# EasyEDA Pro project ProPrj_ETHlink8xADC_2025-03-31.epro, board ETHlink8xADC_PCB
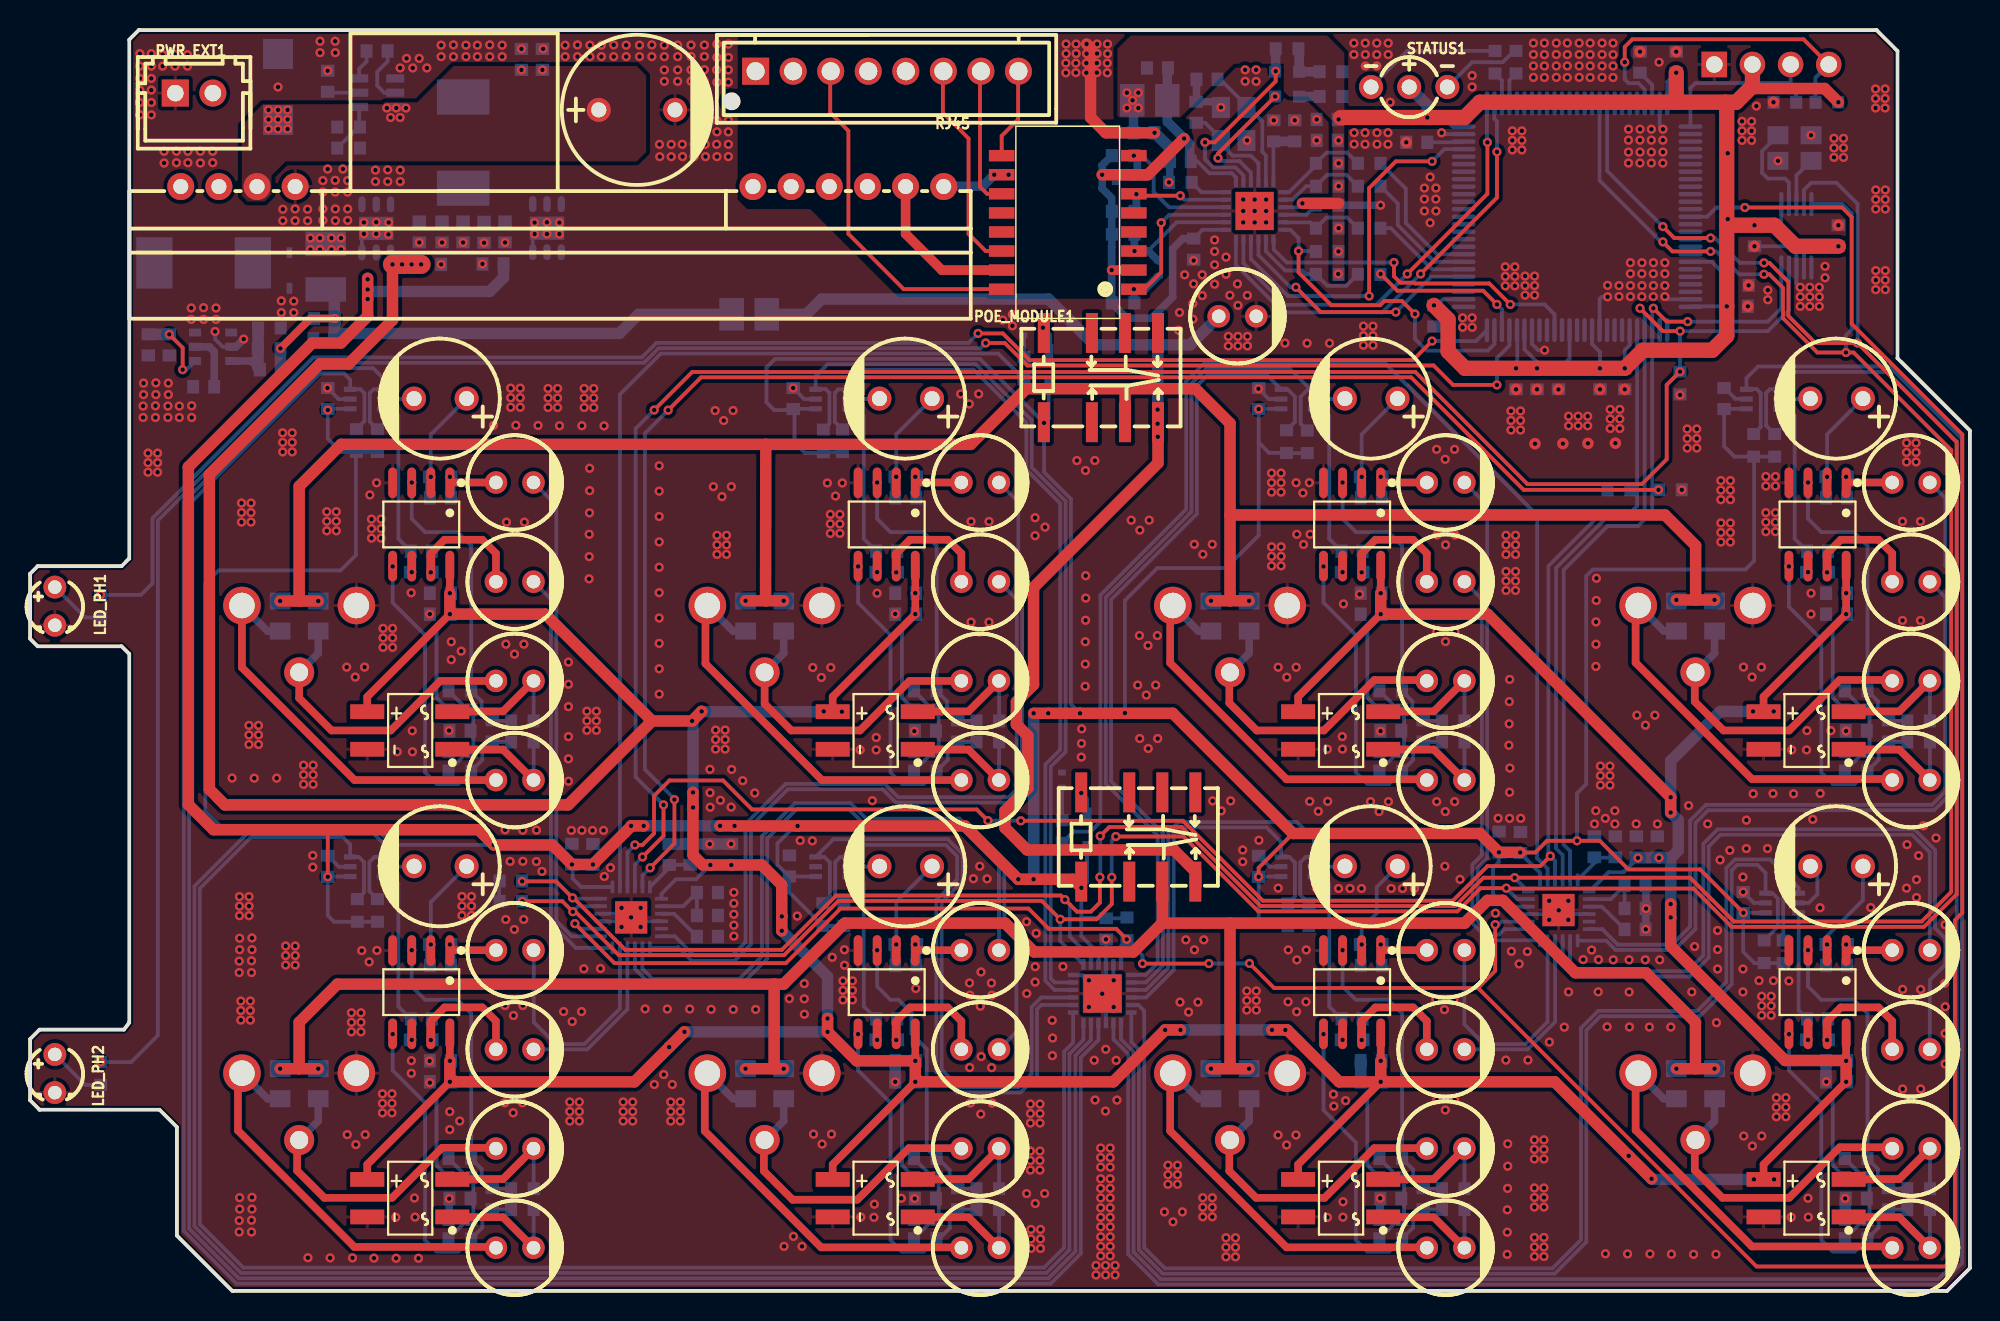
[diagram p13: board, top side]
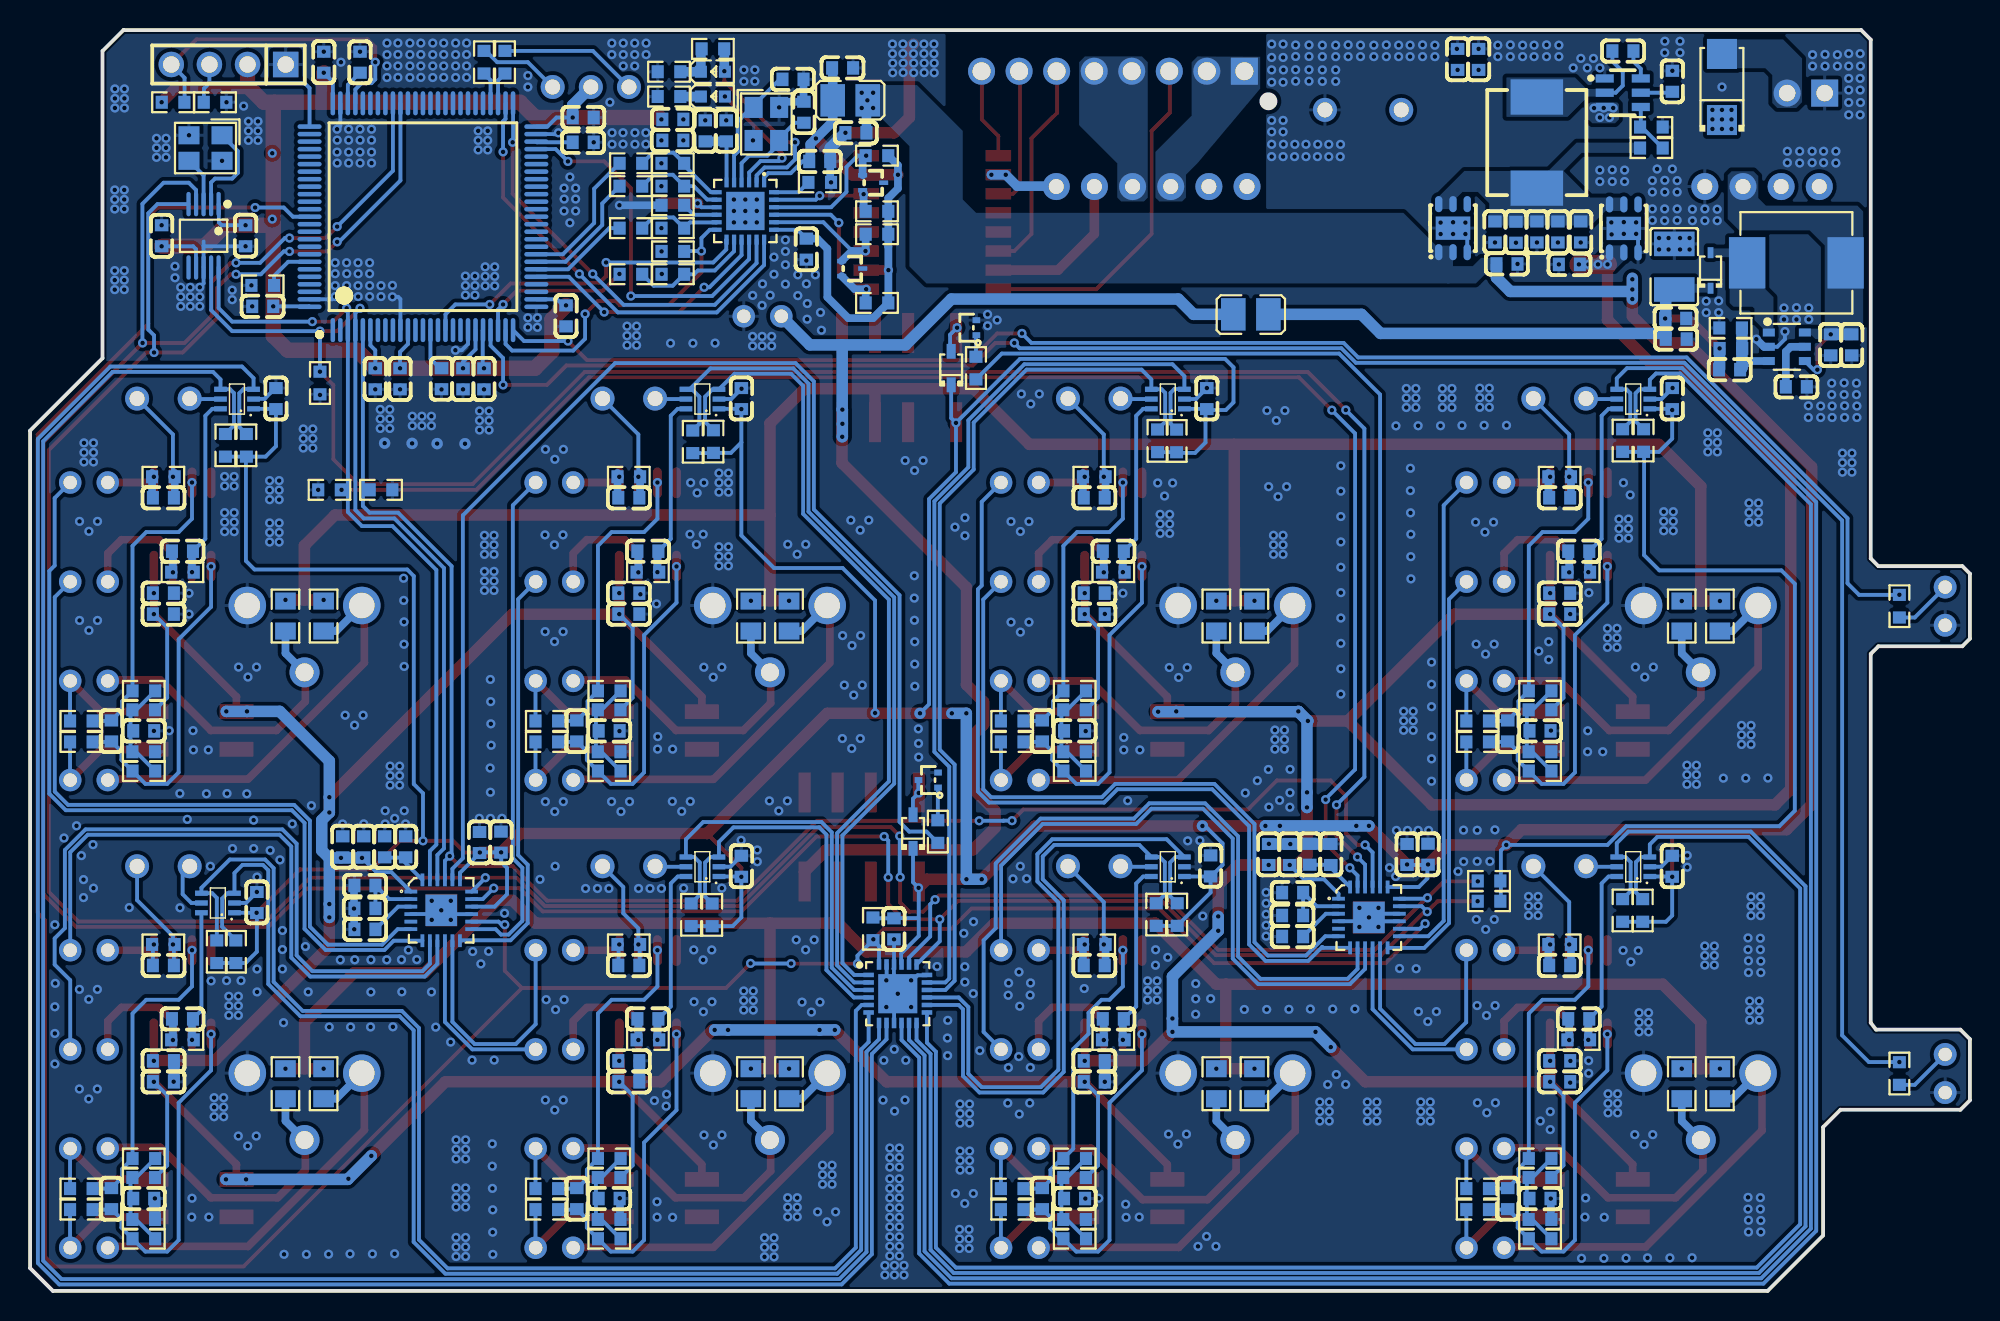
[diagram p14: board, bottom side, seen from below]

Outline 129.16 x 83.95 mm; copper layers: Top Layer, Bottom Layer. Coordinates in mm from the lower left corner of the outline.
Outline path: 0,47.75 0,43.43 0.51,42.93 6.1,42.93 6.6,42.42 6.6,17.86 6.25,17.4 0.64,17.4 0,16.76 0,12.7 0.64,12.06 8.62,12.06 9.78,10.91 9.78,3.69 13.47,0 127.64,0 129.16,1.52 129.16,57.28 124.33,62.1 124.33,82.56 122.94,83.95 7.25,83.95 6.6,83.31 6.6,48.77 6.1,48.26 0.51,48.26 0,47.75
Stack: Top Layer 0.035mm / Dielectric1 1.51mm FR4 er 4.5 / Bottom Layer 0.035mm

## Design rules (mm)
template: JLCPCB Capability(Two Layers Board)
spacing copperThickness1oz (default): track to track 0.102, other pairs 0.152 to 0.3
spacing copperThickness2oz: track to track 0.203, other pairs 0.152 to 0.3
track width copperThickness1oz (default): min 0.127, default 0.254, max 2.54
track width copperThickness2oz: min 0.203, default 0.254, max 2.54
differential pair differentialPair (default): width min 0.127, default 0.254, max 2.54; gap min 0.152, default 0.152
via viaSize (default): diameter min 0.5, default 0.61, max 10; hole min 0.3, default 0.305, max 6.3

## Placement (name value [footprint] x y rotation side)
B1  MB110S  [MBS_L4.7-W4.0-P2.50-LS7.0-TL]  25.28 37.32 180 top
B2  MB110S  [MBS_L4.7-W4.0-P2.50-LS7.0-TL]  56.27 37.32 180 top
B3  MB110S  [MBS_L4.7-W4.0-P2.50-LS7.0-TL]  118.25 37.32 180 top
B4  MB110S  [MBS_L4.7-W4.0-P2.50-LS7.0-TL]  118.25 6.18 180 top
B5  MB110S  [MBS_L4.7-W4.0-P2.50-LS7.0-TL]  87.26 37.32 180 top
B6  MB110S  [MBS_L4.7-W4.0-P2.50-LS7.0-TL]  25.28 6.18 180 top
B7  MB110S  [MBS_L4.7-W4.0-P2.50-LS7.0-TL]  56.27 6.18 180 top
B8  MB110S  [MBS_L4.7-W4.0-P2.50-LS7.0-TL]  87.26 6.18 180 top
C1  860020773013  [CAP-TH_BD6.3-P2.50-D0.5-FD]  32.27 40.62 0 top
C2  860020773013  [CAP-TH_BD6.3-P2.50-D0.5-FD]  32.27 34.02 0 top
C3  860020773013  [CAP-TH_BD6.3-P2.50-D0.5-FD]  32.27 53.83 0 top
C4  860020773013  [CAP-TH_BD6.3-P2.50-D0.5-FD]  32.27 47.22 0 top
C5  100pF  [C0603]  27.32 52.81 0 bottom
C6  2.2nF  [C0603]  30.78 37.29 90 bottom
C7  1000uF  [CAP-TH_BD8.0-P3.50-D0.6-FD-2]  27.32 59.42 180 top
C8  10uF  [C0603]  28.63 37.29 0 bottom
C9  10uF  [C0603]  27.32 45.06 0 bottom
C10  100nF  [C0603]  27.32 46.46 0 bottom
C11  100nF  [C0603]  19.82 59.42 270 bottom
C12  2.2nF  [C0603]  61.77 37.29 90 bottom
C13  100pF  [C0603]  58.3 52.81 0 bottom
C14  100pF  [C0603]  57.04 49.26 0 bottom
C15  10uF  [C0603]  58.3 46.46 0 bottom
C16  100nF  [C0603]  58.3 45.06 0 bottom
C17  1000uF  [CAP-TH_BD8.0-P3.50-D0.6-FD-2]  58.3 59.42 180 top
C18  100nF  [C0603]  50.81 59.42 270 bottom
C19  10uF  [C0603]  59.61 37.29 0 bottom
C20  860020773013  [CAP-TH_BD6.3-P2.50-D0.5-FD]  63.26 40.62 0 top
C21  860020773013  [CAP-TH_BD6.3-P2.50-D0.5-FD]  63.26 34.02 0 top
C22  860020773013  [CAP-TH_BD6.3-P2.50-D0.5-FD]  63.26 53.83 0 top
C23  860020773013  [CAP-TH_BD6.3-P2.50-D0.5-FD]  63.26 47.22 0 top
C24  2.2nF  [C0603]  123.74 37.29 90 bottom
C25  100pF  [C0603]  120.28 52.81 0 bottom
C26  100pF  [C0603]  119.01 49.26 0 bottom
C27  10uF  [C0603]  120.28 46.46 0 bottom
C28  100nF  [C0603]  120.28 45.06 0 bottom
C29  1000uF  [CAP-TH_BD8.0-P3.50-D0.6-FD-2]  120.28 59.42 180 top
C30  100nF  [C0603]  112.79 59.42 270 bottom
C31  10uF  [C0603]  121.59 37.29 0 bottom
C32  860020773013  [CAP-TH_BD6.3-P2.50-D0.5-FD]  125.23 40.62 0 top
C33  860020773013  [CAP-TH_BD6.3-P2.50-D0.5-FD]  125.23 34.02 0 top
C34  860020773013  [CAP-TH_BD6.3-P2.50-D0.5-FD]  125.23 53.83 0 top
C35  860020773013  [CAP-TH_BD6.3-P2.50-D0.5-FD]  125.23 47.22 0 top
C36  2.2nF  [C0603]  123.74 6.15 90 bottom
C37  100pF  [C0603]  120.28 21.67 0 bottom
C38  100pF  [C0603]  119.01 18.12 0 bottom
C39  10uF  [C0603]  120.28 15.32 0 bottom
C40  100nF  [C0603]  120.28 13.93 0 bottom
C41  1000uF  [CAP-TH_BD8.0-P3.50-D0.6-FD-2]  120.28 28.28 180 top
C42  100nF  [C0603]  114.06 25.86 270 bottom
C43  10uF  [C0603]  121.59 6.15 0 bottom
C44  860020773013  [CAP-TH_BD6.3-P2.50-D0.5-FD]  125.23 9.48 0 top
C45  860020773013  [CAP-TH_BD6.3-P2.50-D0.5-FD]  125.23 2.88 0 top
C46  860020773013  [CAP-TH_BD6.3-P2.50-D0.5-FD]  125.23 22.69 0 top
C47  860020773013  [CAP-TH_BD6.3-P2.50-D0.5-FD]  125.23 16.08 0 top
C48  100pF  [C0603]  26.05 49.26 0 bottom
C49  2.2nF  [C0603]  92.75 37.29 90 bottom
C50  100pF  [C0603]  89.29 52.81 0 bottom
C51  100pF  [C0603]  88.02 49.26 0 bottom
C52  10uF  [C0603]  89.29 46.46 0 bottom
C53  100nF  [C0603]  89.29 45.06 0 bottom
C54  1000uF  [CAP-TH_BD8.0-P3.50-D0.6-FD-2]  89.29 59.42 180 top
C55  100nF  [C0603]  81.8 59.42 270 bottom
C56  10uF  [C0603]  90.6 37.29 0 bottom
C57  860020773013  [CAP-TH_BD6.3-P2.50-D0.5-FD]  94.25 40.62 0 top
C58  860020773013  [CAP-TH_BD6.3-P2.50-D0.5-FD]  94.25 34.02 0 top
C59  860020773013  [CAP-TH_BD6.3-P2.50-D0.5-FD]  94.25 53.83 0 top
C60  860020773013  [CAP-TH_BD6.3-P2.50-D0.5-FD]  94.25 47.22 0 top
C61  2.2nF  [C0603]  30.78 6.15 90 bottom
C62  100pF  [C0603]  27.32 21.67 0 bottom
C63  100pF  [C0603]  26.05 18.12 0 bottom
C64  10uF  [C0603]  27.32 15.32 0 bottom
C65  100nF  [C0603]  27.32 13.93 0 bottom
C66  1000uF  [CAP-TH_BD8.0-P3.50-D0.6-FD-2]  27.32 28.28 180 top
C67  100nF  [C0603]  19.82 28.28 270 bottom
C68  10uF  [C0603]  28.63 6.15 0 bottom
C69  860020773013  [CAP-TH_BD6.3-P2.50-D0.5-FD]  32.27 9.48 0 top
C70  860020773013  [CAP-TH_BD6.3-P2.50-D0.5-FD]  32.27 2.88 0 top
C71  860020773013  [CAP-TH_BD6.3-P2.50-D0.5-FD]  32.27 22.69 0 top
C72  860020773013  [CAP-TH_BD6.3-P2.50-D0.5-FD]  32.27 16.08 0 top
C73  2.2nF  [C0603]  61.77 6.15 90 bottom
C74  100pF  [C0603]  58.3 21.67 0 bottom
C75  100pF  [C0603]  57.04 18.12 0 bottom
C76  10uF  [C0603]  58.3 13.93 0 bottom
C77  100nF  [C0603]  58.3 15.32 0 bottom
C78  1000uF  [CAP-TH_BD8.0-P3.50-D0.6-FD-2]  58.3 28.28 180 top
C79  100nF  [C0603]  50.56 28.3 270 bottom
C80  10uF  [C0603]  59.61 6.15 0 bottom
C81  860020773013  [CAP-TH_BD6.3-P2.50-D0.5-FD]  63.26 9.48 0 top
C82  860020773013  [CAP-TH_BD6.3-P2.50-D0.5-FD]  63.26 2.88 0 top
C83  860020773013  [CAP-TH_BD6.3-P2.50-D0.5-FD]  63.26 22.69 0 top
C84  860020773013  [CAP-TH_BD6.3-P2.50-D0.5-FD]  63.26 16.08 0 top
C85  2.2nF  [C0603]  92.75 6.15 90 bottom
C86  100pF  [C0603]  89.29 21.67 0 bottom
C87  100pF  [C0603]  88.02 18.12 0 bottom
C88  10uF  [C0603]  89.29 15.32 0 bottom
C89  100nF  [C0603]  89.29 13.93 0 bottom
C90  1000uF  [CAP-TH_BD8.0-P3.50-D0.6-FD-2]  89.29 28.28 180 top
C91  100nF  [C0603]  81.8 28.28 270 bottom
C92  10uF  [C0603]  90.6 6.15 0 bottom
C93  860020773013  [CAP-TH_BD6.3-P2.50-D0.5-FD]  94.25 9.48 0 top
C94  860020773013  [CAP-TH_BD6.3-P2.50-D0.5-FD]  94.25 2.88 0 top
C95  860020773013  [CAP-TH_BD6.3-P2.50-D0.5-FD]  94.25 22.69 0 top
C96  860020773013  [CAP-TH_BD6.3-P2.50-D0.5-FD]  94.25 16.08 0 top
C97  10uF  [C0603]  46.69 29.06 270 bottom
C98  100nF  [C0603]  45.29 29.06 270 bottom
C99  10uF  [C0603]  45.1 23.6 0 bottom
C100  10uF  [C0603]  45.1 26.52 0 bottom
C101  100nF  [C0603]  45.1 25 180 bottom
C102  10uF  [C0603]  43.95 29.08 90 bottom
C103  100nF  [C0603]  42.56 29.06 270 bottom
C104  10uF  [C0603]  36.08 29.08 90 bottom
C105  100nF  [C0603]  37.48 29.06 270 bottom
C106  10uF  [C0603]  108.34 29.57 270 bottom
C107  100nF  [C0603]  106.95 29.57 270 bottom
C108  10uF  [C0603]  106.86 24.07 0 bottom
C109  10uF  [C0603]  106.86 27 0 bottom
C110  100nF  [C0603]  106.86 25.47 180 bottom
C111  10uF  [C0603]  105.55 29.57 90 bottom
C112  100nF  [C0603]  104.15 29.57 270 bottom
C113  10uF  [C0603]  97.81 29.88 90 bottom
C114  100nF  [C0603]  99.23 29.86 270 bottom
C115  100nF  [C0603]  71.64 24.11 90 bottom
C184  10uF  [C0603]  120.4 70.25 90 bottom
C185  10uF  [C0603]  114.81 70.25 270 bottom
C192  100nF  [C0603]  32.72 82 270 bottom
C193  100nF  [C0603]  23.11 82.56 0 bottom
C194  10uF  [C0603]  31.62 70.51 90 bottom
C195  10uF  [C0603]  27.43 70.51 90 bottom
C196  10uF  [C0603]  28.83 70.51 90 bottom
C197  10uF  [C0603]  25.92 70.51 90 bottom
C198  1000uF  [CAP-TH_BD10.0-P5.00-D1.0-FD]  40.41 78.64 0 top
C201  100nF  [C0603]  19.81 80.54 90 bottom
C202  10uF  [C0603]  30.82 68.38 180 bottom
C203  10uF  [C0603]  30.23 70.49 270 bottom
C204  10uF  [C0603]  26.67 68.35 0 bottom
C206  1uF  [C0603]  11.56 60.2 0 bottom
C207  1uF  [C0603]  9.27 62.99 90 bottom
C208  1uF  [C0603]  7.87 62.99 90 bottom
C210  1uF  [C0603]  34.11 82 270 bottom
C211  10pF  [C0603]  16 61.34 0 bottom
C212  4.7uF  [C1210]  19.69 68.2 270 bottom
C214  100nF  [C0603]  77.47 69.37 90 bottom
C215  10uF  [C0603]  75.06 81.43 180 bottom
C216  1uF  [C0603]  84.2 77.24 270 bottom
C217  100nF  [C0603]  76.58 75.21 0 bottom
C218  10uF  [C0603]  74.17 77.11 180 bottom
C219  10pF  [C0603]  77.64 78.48 270 bottom
C220  470pF  [C0603]  82.81 77.24 270 bottom
C221  10pF  [C0603]  78.36 80.67 180 bottom
C223  100nF  [C0603]  86.36 78 0 bottom
C224  10uF  [C0603]  86.36 76.6 180 bottom
C225  100nF  [C0603]  109.6 81.81 270 bottom
C228  2.2uF  [C0603]  92.33 76.48 180 bottom
C229  2.2uF  [C0603]  107.19 81.81 90 bottom
C230  100nF  [C0603]  104.52 60.73 90 bottom
C231  100nF  [C0603]  106.17 60.73 90 bottom
C232  100nF  [C0603]  92.33 78.13 0 bottom
C233  100nF  [C0603]  98.93 60.73 90 bottom
C234  100nF  [C0603]  113.67 65.56 180 bottom
C235  100nF  [C0603]  100.33 60.73 90 bottom
C236  100nF  [C0603]  93.47 64.92 90 bottom
C237  100nF  [C0603]  101.76 60.74 90 bottom
C240  860020773013  [CAP-TH_BD6.3-P2.50-D0.5-FD]  80.39 64.9 0 top
C241  100nF  [C0603]  19.56 63.37 180 bottom
C242  100nF  [C0603]  19.59 64.75 180 bottom
D1  1N4148WS  [SOD-323_L1.7-W1.3-LS2.5-RD-1]  67.83 61.45 90 bottom
D2  1N4148WS  [SOD-323_L1.7-W1.3-LS2.5-RD-1]  70.37 30.59 90 bottom
D3  SS34  [SMA_L4.3-W2.6-LS5.2-RD]  16.51 80.16 90 bottom
D4  PMEG6010CEJ,115  [SOD-323F_L2.0-W1.6-LS2.5-RD]  17.27 67.94 90 bottom
D5  BZB984-C3V9,115  [SOT-663-3_L1.6-W1.2-P1.00-LS1.6-BR]  74.42 68.07 0 bottom
D6  BZB984-C3V9,115  [SOT-663-3_L1.6-W1.2-P1.00-LS1.6-BR]  73.02 73.79 0 bottom
DP1  MCP4017T-503E/LT  [SC-70-6_L2.0-W1.3-P0.65-LS2.1-BL]  22.41 59.38 90 bottom
DP2  MCP4017T-503E/LT  [SC-70-6_L2.0-W1.3-P0.65-LS2.1-BL]  53.4 59.38 90 bottom
DP3  MCP4017T-503E/LT  [SC-70-6_L2.0-W1.3-P0.65-LS2.1-BL]  115.38 59.38 90 bottom
DP4  MCP4017T-503E/LT  [SC-70-6_L2.0-W1.3-P0.65-LS2.1-BL]  116.65 25.83 90 bottom
DP5  MCP4017T-503E/LT  [SC-70-6_L2.0-W1.3-P0.65-LS2.1-BL]  84.39 59.38 90 bottom
DP6  MCP4017T-503E/LT  [SC-70-6_L2.0-W1.3-P0.65-LS2.1-BL]  22.41 28.24 90 bottom
DP7  MCP4017T-503E/LT  [SC-70-6_L2.0-W1.3-P0.65-LS2.1-BL]  53.4 28.24 90 bottom
DP8  MCP4017T-503E/LT  [SC-70-6_L2.0-W1.3-P0.65-LS2.1-BL]  84.39 28.24 90 bottom
L1  4.7uH  [IND-SMD_L7.0-W6.6_0630CDMCCDS]  28.84 76.46 270 bottom
L2  6.8uH  [IND-SMD_L7.3-W6.6]  11.56 68.45 180 bottom
L3  PT61017PEL  [XFMR-SMD_PT61017PEL]  69.09 71.14 90 top
L4  1uH  [L1008]  74.55 79.27 180 bottom
L5  1uH  [L1008]  47.88 65.02 0 bottom
LED1  MHT192JGCT  [LED0603-RD]  83.7 81.18 180 bottom
LED2  MHT192JGCT  [LED0603-RD]  83.7 79.53 180 bottom
LED_PH1  XL-302SURD  [LED-TH_BD3.8-P2.54-RD]  1.65 45.59 90 top
LED_PH2  XL-302SURD  [LED-TH_BD3.8-P2.54-RD]  1.65 14.48 90 top
NOREF  -  [Pad_e676]  81.54 71.91 0 top
NOREF#2  -  [Pad_e6815]  40.03 24.87 0 top
NOREF#3  -  [Pad_e4968]  71.4 19.8 0 top
NOREF#4  -  [Pad_e5634]  101.76 25.36 0 top
POE_MODULE1  DP9700 at-12V2A  [PWRM-TH_DP9700-XX]  35.43 73.53 180 top
PWR_EXT1  ZX-XH2.54-2PZZ  [CONN-TH_2P-P2.50_HX25003-2A]  10.92 79.76 0 top
Q1  MMBT2222AT-7-F  [SOT-523-3_L1.6-W0.8-P1.00-LS1.6-BR]  66.8 64.13 180 bottom
Q2  MMBT2222AT-7-F  [SOT-523-3_L1.6-W0.8-P1.00-LS1.6-BR]  69.35 34.02 180 bottom
R1  10kΩ  [R0603]  27.32 54.21 0 bottom
R2  10kΩ  [R0603]  26.05 47.86 0 bottom
R3  12Ω  [R0603]  32.78 37.95 180 bottom
R4  12Ω  [R0603]  32.78 36.56 180 bottom
R5  6.8kΩ  [R0805]  16.65 44.94 270 bottom
R6  6.8kΩ  [R0805]  19.19 44.94 90 bottom
R7  10kΩ  [R0603]  28.62 39.95 0 bottom
R8  10kΩ  [R0603]  28.62 34.62 180 bottom
R9  10kΩ  [R0603]  28.63 35.9 180 bottom
R10  10kΩ  [R0603]  28.63 38.69 0 bottom
R11  10kΩ  [R0603]  58.3 54.21 0 bottom
R12  10kΩ  [R0603]  57.04 47.86 0 bottom
R13  12Ω  [R0603]  63.77 37.95 180 bottom
R14  12Ω  [R0603]  63.77 36.56 180 bottom
R15  6.8kΩ  [R0805]  47.64 44.94 270 bottom
R16  6.8kΩ  [R0805]  50.18 44.94 90 bottom
R17  10kΩ  [R0603]  59.61 39.95 0 bottom
R18  10kΩ  [R0603]  59.61 34.62 180 bottom
R19  10kΩ  [R0603]  59.61 35.9 180 bottom
R20  10kΩ  [R0603]  59.61 38.69 0 bottom
R21  10kΩ  [R0603]  120.28 54.21 0 bottom
R22  10kΩ  [R0603]  119.01 47.86 0 bottom
R23  12Ω  [R0603]  125.74 37.95 180 bottom
R24  12Ω  [R0603]  125.74 36.56 180 bottom
R25  6.8kΩ  [R0805]  109.61 44.94 270 bottom
R26  6.8kΩ  [R0805]  112.15 44.94 90 bottom
R27  10kΩ  [R0603]  121.58 39.95 0 bottom
R28  10kΩ  [R0603]  121.58 34.62 180 bottom
R29  10kΩ  [R0603]  121.59 35.9 180 bottom
R30  10kΩ  [R0603]  121.59 38.69 0 bottom
R31  10kΩ  [R0603]  120.28 23.07 0 bottom
R32  10kΩ  [R0603]  119.01 16.72 0 bottom
R33  12Ω  [R0603]  125.74 6.81 180 bottom
R34  12Ω  [R0603]  125.74 5.42 180 bottom
R35  6.8kΩ  [R0805]  109.61 13.8 270 bottom
R36  6.8kΩ  [R0805]  112.15 13.8 90 bottom
R37  10kΩ  [R0603]  121.58 8.81 0 bottom
R38  10kΩ  [R0603]  121.58 3.48 180 bottom
R39  10kΩ  [R0603]  121.59 4.76 180 bottom
R40  10kΩ  [R0603]  121.59 7.55 0 bottom
R41  10kΩ  [R0603]  89.29 54.21 0 bottom
R42  10kΩ  [R0603]  88.02 47.86 0 bottom
R43  12Ω  [R0603]  94.75 37.95 180 bottom
R44  12Ω  [R0603]  94.75 36.56 180 bottom
R45  6.8kΩ  [R0805]  78.62 44.94 270 bottom
R46  6.8kΩ  [R0805]  81.17 44.94 90 bottom
R47  10kΩ  [R0603]  90.59 39.95 0 bottom
R48  10kΩ  [R0603]  90.59 34.62 180 bottom
R49  10kΩ  [R0603]  90.6 35.9 180 bottom
R50  10kΩ  [R0603]  90.6 38.69 0 bottom
R51  10kΩ  [R0603]  27.32 23.07 0 bottom
R52  10kΩ  [R0603]  26.05 16.72 0 bottom
R53  12Ω  [R0603]  32.78 6.81 180 bottom
R54  12Ω  [R0603]  32.78 5.42 180 bottom
R55  6.8kΩ  [R0805]  16.65 13.8 270 bottom
R56  6.8kΩ  [R0805]  19.19 13.8 90 bottom
R57  10kΩ  [R0603]  28.62 8.81 0 bottom
R58  10kΩ  [R0603]  28.62 3.48 180 bottom
R59  10kΩ  [R0603]  28.63 4.76 180 bottom
R60  10kΩ  [R0603]  28.63 7.55 0 bottom
R61  10kΩ  [R0603]  58.3 23.07 0 bottom
R62  10kΩ  [R0603]  57.04 16.72 0 bottom
R63  12Ω  [R0603]  63.77 6.81 180 bottom
R64  12Ω  [R0603]  63.77 5.42 180 bottom
R65  6.8kΩ  [R0805]  47.64 13.8 270 bottom
R66  6.8kΩ  [R0805]  50.18 13.8 90 bottom
R67  10kΩ  [R0603]  59.61 8.81 0 bottom
R68  10kΩ  [R0603]  59.61 3.48 180 bottom
R69  10kΩ  [R0603]  59.61 4.76 180 bottom
R70  10kΩ  [R0603]  59.61 7.55 0 bottom
R71  10kΩ  [R0603]  89.29 23.07 0 bottom
R72  10kΩ  [R0603]  88.02 16.72 0 bottom
R73  12Ω  [R0603]  94.75 6.81 180 bottom
R74  12Ω  [R0603]  94.75 5.42 180 bottom
R75  6.8kΩ  [R0805]  78.62 13.8 270 bottom
R76  6.8kΩ  [R0805]  81.17 13.8 90 bottom
R77  10kΩ  [R0603]  90.59 8.81 0 bottom
R78  10kΩ  [R0603]  90.59 3.48 180 bottom
R79  10kΩ  [R0603]  90.6 4.76 180 bottom
R80  10kΩ  [R0603]  90.6 7.55 0 bottom
R81  10kΩ  [R0603]  66.18 61.45 270 bottom
R82  10kΩ  [R0603]  68.72 30.59 270 bottom
R83  4.7kΩ  [R0603]  73.04 24.11 90 bottom
R84  4.7kΩ  [R0603]  23.13 56.62 270 bottom
R85  4.7kΩ  [R0603]  21.73 56.62 270 bottom
R86  4.7kΩ  [R0603]  54.09 56.6 270 bottom
R87  4.7kΩ  [R0603]  52.82 56.6 270 bottom
R88  4.7kΩ  [R0603]  85.04 56.54 270 bottom
R89  4.7kΩ  [R0603]  83.66 56.55 270 bottom
R90  4.7kΩ  [R0603]  116.15 56.3 270 bottom
R91  4.7kΩ  [R0603]  114.76 56.3 270 bottom
R92  4.7kΩ  [R0603]  23.13 25.33 270 bottom
R93  4.7kΩ  [R0603]  21.79 25.33 270 bottom
R94  4.7kΩ  [R0603]  54.18 25.06 270 bottom
R95  4.7kΩ  [R0603]  52.78 25.06 270 bottom
R96  4.7kΩ  [R0603]  85.14 25.05 270 bottom
R97  4.7kΩ  [R0603]  83.74 25.04 270 bottom
R98  4.7kΩ  [R0603]  116.73 22.59 270 bottom
R99  4.7kΩ  [R0603]  115.45 22.59 270 bottom
R116  4.7kΩ  [R0603]  32.02 27.3 180 bottom
R117  4.7kΩ  [R0603]  32.02 25.95 180 bottom
R120  470Ω  [R0603]  4.7 45.59 90 bottom
R121  470Ω  [R0603]  4.7 14.48 90 bottom
R123  10kΩ  [R0603]  21.21 77.49 180 bottom
R124  33kΩ  [R0603]  21.21 76.1 0 bottom
R125  1MΩ  [R0603]  15.92 62.75 0 bottom
R126  34.8kΩ  [R0603]  15.94 64.12 180 bottom
R127  47Ω  [R0603]  72.77 70.36 180 bottom
R128  47Ω  [R0603]  72.77 65.79 180 bottom
R129  47Ω  [R0603]  72.77 75.59 180 bottom
R130  47Ω  [R0603]  72.77 71.88 180 bottom
R131  12.1kΩ  [R0603]  76.58 73.81 180 bottom
R132  47Ω  [R0603]  89.16 73.56 0 bottom
R133  47Ω  [R0603]  89.16 75.08 0 bottom
R134  4.7kΩ  [R0603]  86.36 72.29 0 bottom
R135  1.5kΩ  [R0603]  86.36 69.21 0 bottom
R136  4.7kΩ  [R0603]  86.36 75.08 0 bottom
R137  4.7kΩ  [R0603]  86.36 73.56 0 bottom
R138  4.7kΩ  [R0603]  86.36 67.69 0 bottom
R139  47Ω  [R0603]  89.15 67.69 180 bottom
R140  4.7kΩ  [R0603]  86.36 70.76 0 bottom
R141  47Ω  [R0603]  89.16 70.76 180 bottom
R142  470Ω  [R0603]  86.62 81.18 0 bottom
R143  470Ω  [R0603]  86.62 79.53 0 bottom
R144  10kΩ  [R0603]  83.7 82.7 0 bottom
R145  10kΩ  [R0603]  113.67 66.95 0 bottom
R146  10kΩ  [R0603]  116.84 79.14 180 bottom
R147  10kΩ  [R0603]  119.64 79.14 0 bottom
R148  470Ω  [R0603]  98.93 81.81 270 bottom
R149  470Ω  [R0603]  97.54 81.81 270 bottom
R150  470Ω  [R0603]  105.79 53.34 180 bottom
R151  470Ω  [R0603]  109.86 60.45 270 bottom
R152  470Ω  [R0603]  109.22 53.34 0 bottom
RJ45  B8B-XH-AM  [CONN-TH_8P-P2.50_B8B-XH-AM-LF-SN]  57.06 81.21 0 top
STATUS1  209UYSYGW/S530-A3/R2  [LED-TH_3P-BD4.0-P2.54]  91.82 80.16 0 top
SW1  HB-PH3-25414PB2GOP  [HDR-TH_4P-P2.54-V-M]  115.95 81.66 0 bottom
U1  LME49721MA/NOPB  [SOIC-8_L4.9-W3.9-P1.27-LS6.0-BL]  26.05 51.03 180 top
U2  LME49721MA/NOPB  [SOIC-8_L4.9-W3.9-P1.27-LS6.0-BL]  57.04 51.03 180 top
U3  LME49721MA/NOPB  [SOIC-8_L4.9-W3.9-P1.27-LS6.0-BL]  119.01 51.03 180 top
U4  LME49721MA/NOPB  [SOIC-8_L4.9-W3.9-P1.27-LS6.0-BL]  119.01 19.89 180 top
U5  LME49721MA/NOPB  [SOIC-8_L4.9-W3.9-P1.27-LS6.0-BL]  88.02 51.03 180 top
U6  LME49721MA/NOPB  [SOIC-8_L4.9-W3.9-P1.27-LS6.0-BL]  26.05 19.89 180 top
U7  LME49721MA/NOPB  [SOIC-8_L4.9-W3.9-P1.27-LS6.0-BL]  88.02 19.89 180 top
U8  LME49721MA/NOPB  [SOIC-8_L4.9-W3.9-P1.27-LS6.0-BL]  57.04 19.89 180 top
U9  TLV320ADC6140IRTWT  [WQFN-24_L4.0-W4.0-P0.50-BL-EP2.1]  40.02 24.87 270 bottom
U10  TLV320ADC6140IRTWT  [WQFN-24_L4.0-W4.0-P0.50-BL-EP2.1]  101.78 25.34 270 bottom
U11  TCA9548ARGER  [VQFN-24_L4.0-W4.0-P0.50-BL-EP2.5]  71.38 19.79 270 bottom
U16  SI5351A-B-GTR  [MSOP-10_L3.0-W3.0-P0.50-LS5.0-BL]  117.6 70.25 0 bottom
U17  STM32H743VIT6  [LQFP-100_L14.0-W14.0-P0.50-LS16.0-BL]  103 71.52 180 bottom
U18  AP62300WU-7  [TSOT-23-6_L2.9-W1.6-P0.95-LS2.8-BL]  23.12 79.78 270 bottom
U19  LD39200PUR  [DFN-6_L3.0-W3.0-P0.95-BL-EP-1]  34.42 70.76 180 bottom
U20  LD39200PUR  [DFN-6_L3.0-W3.0-P0.95-BL-EP-1]  23.05 70.74 180 bottom
U21  LT8330ES6#TRPBF  [TSOT-23-6_L2.9-W1.6-P0.95-LS2.8-BR]  12.19 62.86 0 bottom
U22  LAN8742A-CZ  [QFN-24_L4.0-W4.0-P0.50-BL-EP2.6]  81.54 71.91 0 bottom
U23  UD2-3NUN  [RELAY-SMD_KEMET_UD2-XXNUN]  71.3 60.81 0 top
U24  UD2-3NUN  [RELAY-SMD_KEMET_UD2-XXNUN]  73.79 30.23 0 top
X1  25MHz  [CRYSTAL-SMD_4P-L3.2-W2.5-BL]  117.48 76.1 0 bottom
X2  25MHz  [CRYSTAL-SMD_4P-L3.2-W2.5-BL]  80.13 77.7 270 bottom
XLR1  NC3FAAV1  [CONN-TH_NC3FAAV1]  17.92 43.41 0 top
XLR2  NC3FAAV1  [CONN-TH_NC3FAAV1]  48.91 43.41 0 top
XLR3  NC3FAAV1  [CONN-TH_NC3FAAV1]  79.89 43.41 0 top
XLR4  NC3FAAV1  [CONN-TH_NC3FAAV1]  110.88 43.41 0 top
XLR5  NC3FAAV1  [CONN-TH_NC3FAAV1]  17.92 12.27 0 top
XLR6  NC3FAAV1  [CONN-TH_NC3FAAV1]  48.91 12.27 0 top
XLR7  NC3FAAV1  [CONN-TH_NC3FAAV1]  79.89 12.27 0 top
XLR8  NC3FAAV1  [CONN-TH_NC3FAAV1]  110.88 12.27 0 top

## Footprints (pads in the part's own frame, mm; a bottom-side part is the same pattern mirrored in y, then rotated)
C0603
  rect 0.8x0.9 smd: 1(-0.7,0) 2(0.7,0)
C1210
  rect 1.635x2.7 smd: 1(-1.518,0) 2(1.518,0)
CAP-TH_BD6.3-P2.50-D0.5-FD
  round 1.5 hole 0.9: 1(-1.25,0) 2(1.25,0)
CAP-TH_BD8.0-P3.50-D0.6-FD-2
  round 1.6 hole 1: 1(-1.75,0) 2(1.75,0)
CAP-TH_BD10.0-P5.00-D1.0-FD
  round 1.6 hole 1: 1(-2.54,0) 2(2.54,0)
CONN-TH_2P-P2.50_HX25003-2A
  rect 1.8x1.8 hole 1.1: 1(-1.25,0)
  round 1.8 hole 1.1: 2(1.25,0)
CONN-TH_8P-P2.50_B8B-XH-AM-LF-SN
  rect 1.8x1.8 hole 1.2: 1(-8.75,0)
  round 1.8 hole 1.2: 2(-6.25,0) 3(-3.75,0) 4(-1.25,0) 5(1.25,0) 6(3.75,0) 7(6.25,0) 8(8.75,0)
CONN-TH_NC3FAAV1
  round 2.5 hole 1.7: 1(3.81,2.225) 2(-3.81,2.225)
  round 2 hole 1.2: 3(0,-2.225)
CRYSTAL-SMD_4P-L3.2-W2.5-BL
  rect 1.4x1.2 smd: 1(-1.1,-0.85) 2(1.1,-0.85) 3(1.1,0.85) 4(-1.1,0.85)
DFN-6_L3.0-W3.0-P0.95-BL-EP-1
  oval 0.49x1.07 smd: 1(-0.95,-1.6) 2(0,-1.6) 3(0.95,-1.6) 4(0.95,1.6) 5(0,1.6) 6(-0.95,1.6)
  rect 2.3x1.55 smd: 7(0,0)
HDR-TH_4P-P2.54-V-M
  rect 1.7x1.7 hole 1.1: 1(-3.81,0)
  round 1.7 hole 1.1: 2(-1.27,0) 3(1.27,0) 4(3.81,0)
IND-SMD_L7.0-W6.6_0630CDMCCDS
  rect 2.35x3.5 smd: 1(-3.035,0) 2(3.035,0)
IND-SMD_L7.3-W6.6
  rect 2.424x3.42 smd: 1(3.278,0) 2(-3.278,0)
L1008
  rect 1.635x2.16 smd: 1(-1.167,0) 2(1.167,0)
LED0603-RD
  rect 0.8x0.8 smd: 1(-0.799,0) 2(0.799,0)
LED-TH_3P-BD4.0-P2.54
  round 1.6 hole 1: 1(-2.54,0) 2(0,0) 3(2.54,0)
LED-TH_BD3.8-P2.54-RD
  round 1.524 hole 0.9: 1(-1.27,0) 2(1.27,0)
LQFP-100_L14.0-W14.0-P0.50-LS16.0-BL
  oval 0.3x1.6 smd: 1(-6,-7.55) 2(-5.5,-7.55) 3(-5,-7.55) 4(-4.5,-7.55) 5(-4,-7.55) 6(-3.5,-7.55) 7(-3,-7.55) 8(-2.5,-7.55) 9(-2,-7.55) 10(-1.5,-7.55) 11(-1,-7.55) 12(-0.5,-7.55) 13(0,-7.55) 14(0.5,-7.55) 15(1,-7.55) 16(1.5,-7.55) 17(2,-7.55) 18(2.5,-7.55) 19(3,-7.55) 20(3.5,-7.55) 21(4,-7.55) 22(4.5,-7.55) 23(5,-7.55) 24(5.5,-7.55) 25(6,-7.55) 51(6,7.55) 52(5.5,7.55) 53(5,7.55) 54(4.5,7.55) 55(4,7.55) 56(3.5,7.55) 57(3,7.55) 58(2.5,7.55) 59(2,7.55) 60(1.5,7.55) 61(1,7.55) 62(0.5,7.55) 63(0,7.55) 64(-0.5,7.55) 65(-1,7.55) 66(-1.5,7.55) 67(-2,7.55) 68(-2.5,7.55) 69(-3,7.55) 70(-3.5,7.55) 71(-4,7.55) 72(-4.5,7.55) 73(-5,7.55) 74(-5.5,7.55) 75(-6,7.55)
  oval 1.6x0.3 smd: 26(7.55,-6) 27(7.55,-5.5) 28(7.55,-5) 29(7.55,-4.5) 30(7.55,-4) 31(7.55,-3.5) 32(7.55,-3) 33(7.55,-2.5) 34(7.55,-2) 35(7.55,-1.5) 36(7.55,-1) 37(7.55,-0.5) 38(7.55,0) 39(7.55,0.5) 40(7.55,1) 41(7.55,1.5) 42(7.55,2) 43(7.55,2.5) 44(7.55,3) 45(7.55,3.5) 46(7.55,4) 47(7.55,4.5) 48(7.55,5) 49(7.55,5.5) 50(7.55,6) 76(-7.55,6) 77(-7.55,5.5) 78(-7.55,5) 79(-7.55,4.5) 80(-7.55,4) 81(-7.55,3.5) 82(-7.55,3) 83(-7.55,2.5) 84(-7.55,2) 85(-7.55,1.5) 86(-7.55,1) 87(-7.55,0.5) 88(-7.55,0) 89(-7.55,-0.5) 90(-7.55,-1) 91(-7.55,-1.5) 92(-7.55,-2) 93(-7.55,-2.5) 94(-7.55,-3) 95(-7.55,-3.5) 96(-7.55,-4) 97(-7.55,-4.5) 98(-7.55,-5) 99(-7.55,-5.5) 100(-7.55,-6)
MBS_L4.7-W4.0-P2.50-LS7.0-TL
  rect 2.265x0.98 smd: 1(-2.833,1.25) 2(-2.833,-1.25) 3(2.833,-1.25) 4(2.833,1.25)
MSOP-10_L3.0-W3.0-P0.50-LS5.0-BL
  oval 0.28x1.62 smd: 1(-1,-2.11) 2(-0.5,-2.11) 3(0,-2.11) 4(0.5,-2.11) 5(1,-2.11) 6(1,2.11) 7(0.5,2.11) 8(0,2.11) 9(-0.5,2.11) 10(-1,2.11)
Pad_e676
  rect 2.54x2.54 smd: 101(0,0)
Pad_e4968
  rect 2.54x2.54 smd: 2(0,0)
Pad_e5634
  rect 2.139x2.151 smd: 101(0,0)
Pad_e6815
  rect 2.139x2.151 smd: 101(0,0)
PWRM-TH_DP9700-XX
  round 1.8 hole 1: 1(-25.4,0) 2(-22.86,0) 3(-20.32,0) 4(-17.78,0) 5(-15.24,0) 6(-12.7,0) 7(17.78,0) 8(20.32,0) 9(22.86,0) 10(25.4,0)
QFN-24_L4.0-W4.0-P0.50-BL-EP2.6
  rect 0.28x0.665 smd: 1(-1.25,-1.907) 2(-0.75,-1.907) 3(-0.25,-1.907) 4(0.25,-1.907) 5(0.75,-1.907) 6(1.25,-1.907) 13(1.25,1.907) 14(0.75,1.907) 15(0.25,1.907) 16(-0.25,1.907) 17(-0.75,1.907) 18(-1.25,1.907)
  rect 0.665x0.28 smd: 7(1.907,-1.25) 8(1.907,-0.75) 9(1.907,-0.25) 10(1.907,0.25) 11(1.907,0.75) 12(1.907,1.25) 19(-1.907,1.25) 20(-1.907,0.75) 21(-1.907,0.25) 22(-1.907,-0.25) 23(-1.907,-0.75) 24(-1.907,-1.25)
  rect 2.55x2.55 smd: 25(0,0)
R0603
  rect 0.806x0.864 smd: 1(-0.753,0) 2(0.753,0)
R0805
  rect 1.133x1.377 smd: 1(-1,0) 2(1,0)
RELAY-SMD_KEMET_UD2-XXNUN
  rect 0.8x2.66 smd: 1(-3.8,-2.97) 2(-0.6,-2.97) 3(1.6,-2.97) 4(3.8,-2.97) 5(3.8,2.97) 6(1.6,2.97) 7(-0.6,2.97) 8(-3.8,2.97)
SC-70-6_L2.0-W1.3-P0.65-LS2.1-BL
  rect 0.35x0.85 smd: 1(-0.65,-1.1) 2(0,-1.1) 3(0.65,-1.1) 4(0.65,1.1) 5(0,1.1) 6(-0.65,1.1)
SMA_L4.3-W2.6-LS5.2-RD
  rect 2x2 smd: 1(-2.2,0) 2(2.2,0)
SOD-323_L1.7-W1.3-LS2.5-RD-1
  rect 0.985x0.6 smd: 1(-1.117,0) 2(1.117,0)
SOD-323F_L2.0-W1.6-LS2.5-RD
  rect 0.73x0.385 smd: 1(-1.185,0) 2(1.185,0)
SOIC-8_L4.9-W3.9-P1.27-LS6.0-BL
  oval 0.588x2.045 smd: 1(-1.905,-2.772) 2(-0.635,-2.772) 3(0.635,-2.772) 4(1.905,-2.772) 5(1.905,2.772) 6(0.635,2.772) 7(-0.635,2.772) 8(-1.905,2.772)
SOT-523-3_L1.6-W0.8-P1.00-LS1.6-BR
  rect 0.51x0.4 smd: 1(0.65,-0.5) 2(0.65,0.5) 3(-0.65,0)
SOT-663-3_L1.6-W1.2-P1.00-LS1.6-BR
  rect 0.6x0.3 smd: 1(0.7,-0.5) 2(0.7,0.5) 3(-0.7,0)
TSOT-23-6_L2.9-W1.6-P0.95-LS2.8-BL
  rect 0.55x1.2 smd: 1(-0.95,-1.2) 2(0,-1.2) 3(0.95,-1.2) 4(0.95,1.2) 5(0,1.2) 6(-0.95,1.2)
TSOT-23-6_L2.9-W1.6-P0.95-LS2.8-BR
  rect 0.8x0.532 smd: 1(1.2,-0.95) 2(1.2,0) 3(1.2,0.95) 4(-1.2,0.95) 5(-1.2,0) 6(-1.2,-0.95)
VQFN-24_L4.0-W4.0-P0.50-BL-EP2.5
  rect 0.3x0.7 smd: 1(-1.25,-1.942) 2(-0.75,-1.942) 3(-0.25,-1.942) 4(0.25,-1.942) 5(0.75,-1.942) 6(1.25,-1.942) 13(1.25,1.942) 14(0.75,1.942) 15(0.25,1.942) 16(-0.25,1.942) 17(-0.75,1.942) 18(-1.25,1.942)
  rect 0.7x0.3 smd: 7(1.948,-1.25) 8(1.948,-0.75) 9(1.948,-0.25) 10(1.948,0.25) 11(1.948,0.75) 12(1.948,1.25) 19(-1.948,1.25) 20(-1.948,0.75) 21(-1.948,0.25) 22(-1.948,-0.25) 23(-1.948,-0.75) 24(-1.948,-1.25)
  rect 2.6x2.6 smd: 25(0.001,-0.001)
WQFN-24_L4.0-W4.0-P0.50-BL-EP2.1
  rect 0.25x0.85 smd: 1(-1.245,-2.025) 2(-0.744,-2.025) 3(-0.244,-2.025) 4(0.257,-2.025) 5(0.754,-2.025) 6(1.255,-2.025) 13(1.255,2.025) 14(0.754,2.025) 15(0.257,2.025) 16(-0.244,2.025) 17(-0.744,2.025) 18(-1.244,2.025)
  rect 0.85x0.25 smd: 7(2.025,-1.254) 8(2.025,-0.756) 9(2.025,-0.256) 10(2.025,0.244) 11(2.025,0.745) 12(2.025,1.245) 19(-2.025,1.245) 20(-2.025,0.745) 21(-2.025,0.244) 22(-2.025,-0.256) 23(-2.025,-0.756) 24(-2.025,-1.254)
  rect 2.1x2.1 smd: 25(0,0.001)
XFMR-SMD_PT61017PEL
  rect 0.76x1.7 smd: 1(-4.445,-4.4) 2(-3.175,-4.4) 3(-1.905,-4.4) 4(-0.635,-4.4) 5(0.635,-4.4) 6(1.905,-4.4) 7(3.175,-4.4) 8(4.445,-4.4) 9(4.445,4.4) 10(3.175,4.4) 11(1.905,4.4) 12(0.635,4.4) 13(-0.635,4.4) 14(-1.905,4.4) 15(-3.175,4.4) 16(-4.445,4.4)

## Nets
As in the schematic, except:
GND: B1.4 B2.4 B3.4 B4.4 B5.4 B6.4 B7.4 B8.4 C8.1 C9.1 C10.1 C11.1 C15.1 C16.1 C18.1 C19.1 C27.1 C28.1 C30.1 C31.1 C39.1 C40.1 C42.1 C43.1 C52.1 C53.1 C55.1 C56.1 C64.1 C65.1 C67.1 C68.1 C76.1 C77.1 C79.1 C80.1 C88.1 C89.1 C91.1 C92.1 C97.1 C98.1 C99.2 C100.2 C101.1 C102.2 C103.1 C104.2 C105.1 C106.1 C107.1 C108.2 C109.2 C110.1 C111.2 C112.1 C113.2 C114.1 C115.1 C184.2 C185.2 C192.1 C194.1 C195.1 C196.1 C197.1 C198.2 C201.2 C202.2 C203.2 C204.2 C206.1 C207.1 C208.1 C210.1 C212.1 C214.1 C215.2 C216.1 C217.1 C218.1 C219.1 C220.1 C221.2 C223.1 C224.2 C225.1 C228.2 C229.2 C230.1 C231.1 C232.1 C233.1 C234.1 C235.1 C236.1 C237.1 C240.2 C241.2 C242.2 DP1.2 DP2.2 DP3.2 DP4.2 DP5.2 DP6.2 DP7.2 DP8.2 LED_PH1.1 LED_PH2.1 NOREF.101 NOREF#2.101 NOREF#3.2 NOREF#4.101 POE_MODULE1.7 PWR_EXT1.1 Q1.2 Q2.2 R9.2 R19.2 R29.2 R39.2 R49.2 R59.2 R69.2 R79.2 R123.2 R126.1 R131.2 R134.2 R142.2 R143.2 R145.2 R146.2 R150.2 R151.2 R152.2 SW1.1 U1.4 U2.4 U3.4 U4.4 U5.4 U6.4 U7.4 U8.4 U9.4 U9.15 U9.16 U9.25 U10.4 U10.15 U10.25 U11.9 U11.18 U11.22 U11.23 U11.25 U16.8 U17.10 U17.19 U17.26 U17.49 U17.74 U17.99 U18.1 U19.3 U19.7 U20.3 U20.7 U21.2 U22.25 X1.2 X1.4 X2.2 X2.4 XLR1.1 XLR2.1 XLR3.1 XLR4.1 XLR5.1 XLR6.1 XLR7.1 XLR8.1

Pads without a net: D5 3; D6 3; L3 4 5 12 13; POE_MODULE1 5 6 9 10; U9 5; U10 5; U16 6; U17 1 2 7 8 9 12 13 15 17 18 28 29 34 35 36 39 40 41 42 43 44 45 46 55 56 57 58 59 60 61 62 63 64 65 68 69 70 71 77 78 79 80 81 82 83 84 85 86 87 89 90 91 92 93 95 96 97 98; U19 4; U20 4; U23 2 5 6 7; U24 2 5 6 7

## Via types
v1: diameter 0.61, hole 0.305, Top Layer to Bottom Layer, 1483 vias
v2: diameter 0.762, hole 0.305, Top Layer to Bottom Layer, 67 vias

## Routing (per net, layer and track width the routed paths; a pad name or vN(x,y) marks a point on that pad's centre or on a via; arc(x,y) is an arc through that point)
12V: length 5.2
  Top Layer w0.254: v1(10.16,61.34) 10.16,62.8 v1(9.27,63.69)
  Bottom Layer w0.254: U21.4 10.42,61.34 v1(10.16,61.34)
  Bottom Layer w0.762: C208.2 v1(9.27,63.69)
  vias: v1(15.88,78.64) v1(15.88,78) v1(15.88,77.37) v1(16.51,78.64) v1(16.51,78) v1(16.51,77.37) v1(17.15,78.64) v1(17.15,78) v1(17.15,77.37) v1(23.75,78.76) v1(24,78.13) v1(24.39,78.76) v1(24.64,78.13) v1(25.03,78.76) v1(32.72,81.3) v1(34.11,81.3)
A3V3: length 462.4
  Top Layer w0.508: B5.3 84.43,39.56 v1(89.93,45.06) ; U2.8 v1(58.94,46.46) v1(58.94,45.06) 53.44,39.56 B2.3 ; v1(89.93,46.46) U5.8 ; v1(27.95,15.32) U6.8 ; v1(58.94,15.32) U8.8 ; B6.3 22.45,8.43 v1(27.95,13.93) ; v1(120.92,13.93) 115.42,8.43 B4.3 ; v1(89.93,13.93) 84.43,8.43 B8.3 ; B1.3 22.45,39.56 v1(27.95,45.06) ; v1(89.93,15.32) U7.8 ; B3.3 115.42,39.56 v1(120.92,45.06) v1(120.92,46.46) U3.8 ; v1(58.94,13.93) 53.44,8.43 B7.3 ; v1(27.95,46.46) U1.8 ; v1(120.92,15.32) U4.8
  Top Layer w0.762: v1(89.93,13.93) 101.51,13.93 v2(106.44,9) v2(107.96,7.47) ; v1(89.93,13.93) v1(89.93,15.32) ; v1(89.93,13.93) 87.16,13.93 83.7,17.38 v2(83.58,17.38) v2(82.69,17.38) ; v2(50.05,23.98) v2(50.05,24.94) 50.05,27.03 48.72,28.36 v2(46.69,28.36) v2(45.29,28.36) 44.8,28.36 44.14,29.02 44.14,32.2 ; v1(27.95,46.46) v1(27.95,45.06) 34.3,45.06 41.41,37.95 ; v2(44.14,32.19) 44.14,32.2 ; 44.14,32.2 v2(44.14,33.19) ; 41.41,37.95 v2(44.08,37.95) v2(44.72,38.59) ; 41.41,37.95 35.83,32.36 12.97,32.36 11.94,33.4 11.94,54.36 19.3,61.72 21.21,61.72 24.13,64.64 v1(24.13,68.35) ; v1(120.92,13.93) v1(120.92,15.32) 120.89,15.35 116.85,15.35 109.23,22.97 v2(109.23,24.87) v2(109.23,25.76) ; v1(89.93,46.46) v1(89.93,45.06) 97.04,45.06 v2(109.23,32.87) v2(109.23,31.86) ; v1(27.95,15.32) v1(27.95,13.93) 40.25,13.93 v2(42.56,16.24) v2(43.57,17.25) ; v2(76.59,17.38) v2(75.58,17.38) 72.12,13.93 v1(58.94,13.93) v1(58.94,15.32) 55.03,15.32 53.1,17.25 v2(53.1,17.25) v2(53.1,18.14)
  Top Layer w1.27: v1(24.13,68.35) v1(24.77,68.35) v1(25.4,68.35) v1(26.04,68.35)
  Bottom Layer w0.254: R80.1 89.04,8.36 89.04,13.04 v1(89.93,13.93) ; R50.1 89.04,39.5 89.04,44.18 v1(89.93,45.06) ; R30.1 120.03,39.5 120.03,44.18 v1(120.92,45.06) ; R40.1 120.03,8.36 120.03,13.04 v1(120.92,13.93) ; v1(107.06,28.84) 107.05,28.84 106.1,27.88 105.1,27.88 U10.1 ; U9.1 42.04,26.45 43.01,27.41 44.34,27.41 v2(45.29,28.36) ; v1(58.94,13.93) 58.05,13.04 58.05,8.36 R70.1 ; v1(58.94,45.06) 58.05,44.18 58.05,39.5 R20.1 ; R10.1 27.06,39.5 27.06,44.18 v1(27.95,45.06) ; R60.1 27.06,8.36 27.06,13.04 v1(27.95,13.93)
  Bottom Layer w0.762: v2(106.44,9) 108.01,7.43 v2(114.77,7.43) v2(116.12,7.43) ; v2(44.14,32.19) 44.14,37.99 44.72,38.57 ; v2(54.05,38.57) 44.72,38.57 ; 44.72,38.57 v2(44.72,38.59) ; 44.72,38.57 44.7,38.57 v2(44.08,37.95) ; v2(75.58,17.38) v2(76.59,17.38) v2(82.69,17.38) v2(83.58,17.38) ; v2(109.23,24.87) v2(109.23,25.76) 109.23,28.84 ; v1(107.06,28.84) v1(108.46,28.84) 109.23,28.84 ; 109.23,28.84 109.25,28.84 109.74,29.33 109.74,31.35 v2(109.23,31.86) v2(109.23,32.87) 109.23,35.29 112.53,38.59 v2(114.72,38.59) v2(116.09,38.59) ; 50.05,24.87 v2(50.05,23.98) 53.1,20.93 v2(53.1,18.14) v2(53.1,17.25) v2(43.57,17.25) v2(42.56,16.24)
  vias: v2(52.84,38.59)
A48V: length 85.3
  Top Layer w0.762: 77.6,26.84 77.6,27.92 76.15,29.37 66.38,29.37 64.91,30.84 64.91,31.96 66.43,33.48 66.43,36.96 65.67,37.72 65.67,39.22 66.81,40.37 66.81,46.84 75.1,55.13 75.1,56.86 v1(75.08,56.87) 75.08,57.68
  Bottom Layer w0.762: 75.09,62.99 70.87,62.99 67.82,66.04 52.7,66.04 51.69,65.02 L5.2 ; 75.09,62.99 75.09,58.69 v1(75.07,58.68) 75.07,56.88 v1(75.08,56.87) ; 75.09,62.99 77.24,62.99 79.01,64.77 79.14,64.77
  vias: v1(75.07,57.74)
D3V3: length 567.2
  Top Layer w0.254: v1(99.21,29.19) 100.22,29.19 101,29.97 v1(103,29.97) 104.51,29.97 106.42,28.07 111.19,28.07 v1(114.08,25.18) ; 37.44,28.39 v1(37.48,28.39) ; 84.09,30.46 81.8,28.17 v1(81.8,27.58) ; 19.82,30.71 19.82,27.54
  Top Layer w0.762: v2(40.86,30.97) 40.05,30.97 v1(37.48,28.39) ; v1(99.21,29.19) 99.21,29.2 v1(97.8,29.2) 96.54,30.46 84.09,30.46 76.08,38.46 v2(69.91,38.46) v1(67.79,38.46) v1(66.82,38.46) ; 114.61,80.16 114.72,80.06 119.48,80.06 v1(120.4,79.14) ; v1(84.71,72.41) 87.12,72.41 ; 22.48,67.43 v1(22.48,66.68) v1(22.48,66.04) 22.48,64.9 20.7,63.12 18.8,63.12 10.54,54.86 10.54,32.38 12.21,30.71 29.86,30.71 v1(30.87,29.7) 34.78,29.7 v1(36.08,28.39) 37.44,28.39 ; v2(45.95,30.97) v2(46.91,30.97) 46.92,30.96 v2(51.1,30.96) 62.25,30.96 65.8,27.41 v1(65.8,27.41) v1(66.81,27.41) 69.43,27.41 v1(70,26.84)
  Top Layer w1.016: 112.97,71.01 112.97,79.04 112.87,79.14 ; 112.97,71.01 113.02,70.96 v1(114.81,70.96) 116.14,70.96 117.54,69.55 v1(120.4,69.55) ; 112.97,71.01 v1(112.97,65.56) 112.97,63.6 112.01,62.63 107.38,62.63 v1(106.17,61.43) v1(104.52,61.43) v1(100.33,61.43) v1(98.93,61.43) 95.54,61.43 94.41,62.56 94.41,64.68 v2(93.47,65.62) ; 109.67,79.21 109.73,79.14 ; 109.73,79.14 112.87,79.14 ; 109.73,79.14 109.6,79.14 ; 112.87,79.14 113.6,79.14 114.68,80.22 SW1.2 ; 109.6,79.14 v1(109.6,81.11) ; 109.6,79.14 96.52,79.14 95.51,78.13 v1(93.03,78.13) 87.25,78.13
  Bottom Layer w0.254: U9.19 36.69,26.9 36.13,27.46 36.13,28.05 36.44,28.36 ; 52.76,55.8 51.59,55.8 50.9,56.49 50.9,58.72 ; 93.47,65.68 93.73,65.68 94.07,66.02 U17.27 ; DP6.1 19.92,27.59 19.87,27.54 ; v1(81.8,58.72) 81.8,56.49 ; 81.8,56.49 81.8,50.3 79.63,48.13 75.06,48.13 72.9,45.97 v1(72.9,38.48) ; 81.8,56.49 82.49,55.8 R89.2 83.67,55.79 R88.2 ; 50.81,27.58 50.56,27.32 50.56,26.53 R95.2 R94.2 ; DP3.1 112.89,58.73 112.84,58.68 112.79,58.68 ; DP7.1 50.91,27.59 50.86,27.54 ; 50.9,58.72 50.86,58.68 ; 50.9,58.72 50.91,58.73 DP2.1 ; 98.93,61.36 99.02,61.45 99.02,63.95 U17.21 ; R92.2 R93.2 20.24,24.58 19.82,25 v1(19.82,27.58) ; R85.2 20.7,55.87 19.82,56.75 v1(19.82,58.65) ; R85.2 R84.2 ; R85.2 21.7,55.83 21.7,48.99 20.68,47.98 12.55,47.98 11.66,47.09 11.66,31.97 12.69,30.94 22.89,30.94 24.14,29.7 v1(30.87,29.7) ; v1(112.97,65.56) 110.58,65.56 110.55,65.52 ; 71.62,24.79 71.64,24.81 73.01,24.81 ; C18.2 50.75,58.65 49.54,58.65 49.03,59.16 49.03,61.5 49.59,62.06 63.25,62.06 v1(67.51,57.8) ; v2(51.1,30.96) 50.92,30.96 49.76,29.8 49.76,28.36 50.54,27.59 ; 100.33,61.3 100.33,61.85 99.5,62.69 U17.20 ; 54.09,55.85 52.83,55.85 R87.2 ; 70.02,24.86 70.05,24.82 71.61,24.82 ; v1(81.8,27.58) 81.8,24.87 82.38,24.29 83.75,24.29 ; v1(106.17,61.43) 106.17,62.63 106.5,62.96 U17.6 ; v1(37.48,28.39) 37.47,28.39 ; U10.16 98.23,25.59 97.4,26.41 97.4,28.17 97.79,28.55 97.79,28.91 ; v1(104.52,61.43) 104.52,62.52 104,63.05 U17.11 ; 31.23,25.93 31.23,29.33 30.89,29.66 ; v1(109.6,81.11) 109,80.51 U17.75 ; v1(67.51,57.8) 67.83,58.12 D1.1 ; v1(67.51,57.8) 67.51,54.52 69.3,52.73 69.3,39.06 v2(69.91,38.46) ; DP1.1 19.92,58.73 19.87,58.68 ; R91.2 113.48,55.55 112.79,56.24 112.79,58.68 ; R91.2 R90.2 ; R91.2 114.79,55.52 114.79,48.61 114.21,48.04 104.05,48.04 103.61,47.6 103.61,33.75 103,33.14 v1(103,29.97) ; 112.79,58.68 C30.2 ; 97.79,28.91 97.8,28.92 v1(97.8,29.2) 99.17,29.2 100.54,27.84 U10.19 ; 97.79,28.91 97.85,28.85 ; DP4.1 v1(114.08,25.18) C42.2 114.06,22.59 114.81,21.83 R99.2 R98.2 ; U22.9 84.45,72.16 v1(84.71,72.41) ; v1(93.03,78.13) 94.11,78.13 94.71,77.52 U17.50 ; 85.14,24.29 83.75,24.29 ; 83.75,24.29 83.74,24.29 ; 118.1,68.15 118.11,68.15 118.11,69.37 118.3,69.55 v1(120.4,69.55) ; v1(114.81,70.96) 116.4,70.96 116.59,71.14 116.59,72.35 U16.1 ; 81.85,27.54 81.9,27.59 DP8.1 ; 36.44,28.36 36.04,28.36 ; 36.44,28.36 37.47,28.36 ; D2.1 70.37,27.21 v1(70,26.84) 69.99,26.83 69.99,23.63 71.16,22.46 71.16,21.78 ; DP5.1 81.9,58.73 81.85,58.68
  Bottom Layer w0.635: L4.2 v1(73.41,79.27) 73.47,79.21 C218.2
  Bottom Layer w0.762: v2(46.91,30.97) v2(45.95,30.97) v2(40.86,30.97) v2(40.02,30.97) ; v1(67.79,38.46) v1(66.82,38.46) 66.82,27.42 v1(66.81,27.41) v1(65.8,27.41) ; 22.48,67.43 v1(22.48,66.68) 22.48,66.55 ; C202.1 31.52,67.46 30.61,66.55 22.48,66.55 ; 22.48,66.55 v1(22.48,66.04) ; v1(93.03,78.13) 93.03,78.95 STATUS1.2
  vias: v1(22.48,67.36) v1(73.03,79.78) v1(73.03,78.76) v1(73.79,79.78) v1(73.79,78.76) v1(87.12,78) v1(87.12,76.6) v1(87.12,75.08) v1(87.12,73.56) v1(87.12,70.76) v1(87.11,69.21) v1(87.1,67.71) v1(113.03,75.75) v1(113.03,71.36)
GND: length 81.6
  Top Layer w0.762: v1(74.87,77.11) 71.63,77.11 70.61,78.13 70.61,82.75 v1(70.34,83.02)
  Bottom Layer w0.254: U19.3 33.47,70.57 33.66,70.76 U19.7 ; 71.64,21.48 71.67,21.45 ; 71.64,21.48 71.64,21.02 71.62,21 ; 71.64,21.48 71.64,21.75 ; 71.64,21.48 71.63,21.49 v1(71.63,23.41) ; U21.2 12.83,62.86 12.32,63.37 v1(12.32,63.88) ; 113.03,59.91 113.54,59.4 114.28,59.4 ; U10.15 100.81,25.09 100.82,25.1 ; U17.10 104.5,66.04 104.65,66.19 v1(105.03,66.19) ; 39.39,25.13 39.38,25.12 37.99,25.12 ; 72.1,20.92 72.13,20.95 72.13,21.75 ; v1(108.85,66.21) 109.03,66.02 110.55,66.02 ; U20.7 22.59,70.74 22.1,70.25 U20.3 ; v1(100.84,62.63) 100.42,62.63 100,63.05 U17.19 ; v1(93.98,77.11) 94.07,77.03 95.45,77.03 ; v1(19.8,60.12) 20.54,59.38 21.33,59.38 ; 71.62,18.64 71.63,18.63 71.63,17.85 ; 115.56,25.84 114.78,25.84 114.14,26.47 ; 70.38,20.7 70.07,21.02 69.46,21.02 ; v1(117.86,66.83) 117.6,67.08 117.6,69.59 ; 117.6,69.59 117.6,69.87 ; 117.6,69.59 117.57,69.55 v2(114.81,69.55) ; 40.85,24.67 40.91,24.62 42.03,24.62 ; 83.3,28.25 82.53,28.25 81.79,28.98 ; v1(108.72,77.35) 108.5,77.57 U17.74 ; 81.83,60.04 81.83,60.03 82.47,59.39 83.29,59.39 ; 103.81,25.09 102.67,25.09 ; 21.32,28.25 20.55,28.25 C67.1 ; 39.24,24.59 39.22,24.61 38,24.61 ; 50.81,60.11 50.82,60.11 51.54,59.39 52.31,59.39
  Bottom Layer w0.508: U21.2 13.72,62.86 v1(14.22,63.37) ; 89.86,6.04 89.88,6.03 89.88,4.74 ; v1(79.28,78.8) 78.91,79.18 C219.1 77.66,79.2 77.66,80.67 ; 27.91,5.95 27.91,4.8 27.88,4.77 ; C217.1 75.88,73.86 v1(75.83,73.81) ; v1(107.59,25.46) 107.59,26.91 107.54,26.96 ; v1(107.57,24.08) 107.58,24.09 107.58,25.53 ; v1(89.92,72.29) R134.2
  Bottom Layer w0.762: 88.59,13.9 88.59,15.34 88.58,15.35 ; 119.57,15.33 119.57,13.98 ; 42.57,29.76 46.67,29.76 46.69,29.78 ; 57.59,13.85 57.6,13.86 57.6,15.34 ; 120.83,4.72 120.85,4.74 v1(120.85,6.16) ; C217.1 75.88,76.1 v1(74.87,77.11)
  vias: v1(7.31,82.38) v1(7.29,81.55) v1(7.31,80.73) v1(7.31,79.96) v1(7.29,79.13) v1(7.31,78.31) v1(7.53,58.92) v1(7.53,58.16) v1(7.56,60.44) v1(7.56,59.68) v1(7.86,55.78) v1(7.86,55.15) v1(7.86,54.51) v1(8.07,82.38) v1(8.07,81.55) v1(8.07,80.73) v1(8.07,79.96) v1(8.07,79.13) v1(8.07,78.31) v1(8.35,58.94) v1(8.35,58.16) v1(8.38,60.46) v1(8.38,59.68) v1(8.49,55.78) v1(8.49,55.15) v1(8.49,54.51) v1(8.83,82.31) v1(8.83,81.55) v1(8.93,75.88) v1(8.93,75.1) v1(9.21,60.44) v1(9.21,59.68) v1(9.18,58.92) v1(9.18,58.16) v1(9.65,82.33) v1(9.65,81.55) v1(9.75,75.88) v1(9.75,75.12) v1(9.94,58.92) v1(9.94,58.16) v1(10.48,82.31) v1(10.48,81.55) v1(10.51,75.88) v1(10.51,75.12) v1(10.73,65.45) v1(10.73,64.69) v1(10.76,58.94) v1(10.76,58.16) v1(11.34,75.88) v1(11.34,75.1) v1(11.55,65.47) v1(11.55,64.69) v1(12.16,75.88) v1(12.16,75.12) v1(12.38,65.45) v1(12.38,64.69) v1(13.45,34.15) v1(13.94,26.26) v1(13.94,25.62) v1(13.94,24.99) v1(13.93,21.96) v1(13.93,21.2) v1(13.93,4.69) v1(13.93,3.93) v1(13.96,23.48) v1(13.96,22.72) v1(14.03,19.3) v1(14.03,18.67) v1(14.03,18.03) v1(13.96,6.21) v1(13.96,5.45) v1(14.08,52.46) v1(14.08,51.83) v1(14.08,51.19) v1(14.58,37.66) v1(14.58,37.02) v1(14.58,36.39) v1(14.58,26.26) v1(14.58,25.62) v1(14.58,24.99) v1(14.71,52.46) v1(14.71,51.83) v1(14.71,51.19) v1(14.75,21.98) v1(14.75,21.2) v1(14.67,19.3) v1(14.67,18.67) v1(14.67,18.03) v1(14.75,4.71) v1(14.75,3.93) v1(14.78,23.5) v1(14.78,22.72) v1(14.78,6.23) v1(14.78,5.45) v1(14.93,34.14) v1(15.21,37.66) v1(15.21,37.02) v1(15.21,36.39) v1(16.42,34.14) v1(16.51,80.16) v1(16.73,65.92) v1(16.73,65.14) v1(16.83,72.02) v1(16.83,71.26) v1(16.82,57.14) v1(16.82,56.5) v1(16.82,55.87) v1(17.02,22.97) v1(17.02,22.33) v1(17.02,21.7) v1(17.45,57.14) v1(17.45,56.5) v1(17.45,55.87) v1(17.65,72.04) v1(17.65,71.26) v1(17.56,65.9) v1(17.56,65.14) v1(17.65,22.97) v1(17.65,22.33) v1(17.65,21.7) v1(18.21,35) v1(18.21,34.37) v1(18.21,33.73) v1(18.48,72.02) v1(18.48,71.26) v1(18.5,2.21) v1(18.67,70.1) v1(18.67,69.34) v1(18.84,35) v1(18.84,34.37) v1(18.84,33.73) v1(18.82,29) v1(18.82,28.21) v1(19.31,83.21) v1(19.31,82.45) v1(19.3,70.1) v1(19.3,69.34) v1(19.5,73.93) v1(19.5,73.17) v1(19.5,72.04) v1(19.5,71.28) v1(19.81,81.24) v1(19.81,74.7) v1(19.75,51.88) v1(19.75,51.25) v1(19.75,50.61) v1(19.98,2.2) v1(20.07,70.1) v1(20.07,69.34) v1(20.31,83.21) v1(20.32,82.45) v1(20.32,73.95) v1(20.32,73.17) v1(20.33,72.04) v1(20.33,71.26) v1(20.39,51.88) v1(20.39,51.25) v1(20.39,50.61) v1(20.7,70.1) v1(20.7,69.34) v1(20.83,74.7) v1(21.15,73.93) v1(21.15,73.17) v1(21.15,72.04) v1(21.15,71.28) v1(21.08,41.54) v1(21.12,10.41) v1(21.4,18.52) v1(21.4,17.89) v1(21.4,17.25) v1(21.47,2.2) v1(21.65,40.87) v1(21.69,9.75) v1(22.03,18.52) v1(22.03,17.89) v1(22.03,17.25) v1(22.08,22.66) v1(22.23,71.14) v1(22.23,70.38) v1(22.28,41.54) v1(22.32,10.41) v1(22.62,53) v1(22.58,21.91) v1(22.73,51.39) v1(22.73,50.76) v1(22.73,50.12) v1(22.9,2.18) v1(22.99,74.63) v1(22.99,73.87) v1(23.05,71.16) v1(23.05,70.38) v1(23.07,53.81) v1(23.09,22.67) v1(23.37,51.39) v1(23.37,50.76) v1(23.37,50.12) v1(23.5,44.12) v1(23.5,43.48) v1(23.5,42.85) v1(23.46,13.13) v1(23.46,12.49) v1(23.46,11.86) v1(23.81,74.65) v1(23.81,73.87) v1(23.88,71.14) v1(23.86,70.34) v1(24.14,44.12) v1(24.14,43.48) v1(24.14,42.85) v1(24.1,13.13) v1(24.1,12.49) v1(24.1,11.86) v1(24.35,4.91) v1(24.45,35.9) v1(24.37,2.17) v1(24.64,81.43) v1(24.65,74.63) v1(24.65,73.87) v1(25.07,82.07) v1(25.37,46.49) v1(25.45,37.3) v1(25.39,15.33) v1(25.39,14.49) v1(25.48,81.43) v1(25.46,35.9) v1(25.59,6.19) v1(25.63,4.92) v1(25.91,82.07) v1(25.92,69.81) v1(25.86,2.18) v1(26.42,81.43) v1(26.62,45.07) v1(26.6,15.32) v1(26.62,13.87) v1(27.37,82.94) v1(27.37,82.18) v1(27.43,69.81) v1(27.37,68.35) v1(27.9,37.31) v1(27.94,11.94) v1(27.94,10.74) v1(27.91,6.15) v1(28.05,43.23) v1(28.05,42.03) v1(28.19,82.97) v1(28.19,82.18) v1(28.61,11.31) v1(28.71,42.6) v1(28.83,69.81) v1(28.76,26.27) v1(28.76,25.63) v1(28.76,25) v1(29.02,82.94) v1(29.02,82.18) v1(29.39,26.27) v1(29.39,25.63) v1(29.39,25) v1(29.78,82.94) v1(29.78,82.18) v1(30.12,68.38) v1(30.23,69.79) v1(30.6,82.97) v1(30.6,82.18) v1(30.86,57.63) v1(31.43,82.94) v1(31.43,82.18) v1(31.62,69.81) v1(31.63,30.7) v1(31.62,19) v1(31.6,12.53) v1(31.72,51.19) v1(31.68,43.06) v1(31.67,24.73) v1(32,60.11) v1(32,59.47) v1(32,58.84) v1(31.97,28.6) v1(32.25,42.4) v1(32.24,24.07) v1(32.19,18.34) v1(32.17,11.86) v1(32.35,57.64) v1(32.29,50.52) v1(32.64,60.11) v1(32.64,59.47) v1(32.64,58.84) v1(32.72,82.7) v1(32.81,30.67) v1(32.81,28.61) v1(32.81,19) v1(32.79,12.53) v1(32.92,51.19) v1(32.88,43.06) v1(32.87,24.73) v1(33.59,71.13) v1(33.59,70.37) v1(33.72,30.68) v1(33.71,28.59) v1(33.82,57.63) v1(34.08,27.93) v1(34.17,82.7) v1(34.41,71.15) v1(34.41,70.37) v1(34.49,60.09) v1(34.49,59.45) v1(34.49,58.82) v1(35.13,60.09) v1(35.13,59.45) v1(35.13,58.82) v1(35.24,71.13) v1(35.24,70.37) v1(35.25,57.61) v1(35.53,18.6) v1(35.63,82.94) v1(35.63,82.18) v1(35.85,41.87) v1(35.85,40.39) v1(35.85,38.9) v1(35.85,36.91) v1(35.85,35.43) v1(35.85,33.94) v1(35.94,12.58) v1(35.94,11.95) v1(35.94,11.31) v1(36.04,30.66) v1(36.1,17.94) v1(36.45,82.97) v1(36.45,82.18) v1(36.57,12.58) v1(36.57,11.95) v1(36.57,11.31) v1(36.74,57.61) v1(36.74,30.67) v1(36.72,18.6) v1(36.89,60.09) v1(36.89,59.45) v1(36.89,58.82) v1(36.87,21.46) v1(37.07,38.6) v1(37.07,37.96) v1(37.07,37.33) v1(37.25,51.81) v1(37.23,50.38) v1(37.23,48.89) v1(37.22,47.41) v1(37.28,82.94) v1(37.28,82.18) v1(37.26,54.78) v1(37.26,53.29) v1(37.45,30.66) v1(37.53,60.09) v1(37.53,59.45) v1(37.53,58.82) v1(37.71,38.6) v1(37.71,37.96) v1(37.71,37.33) v1(38.04,82.94) v1(38.04,82.18) v1(37.98,21.47) v1(38.22,57.6) v1(38.18,30.66) v1(38.23,27.6) v1(38.65,28.18) v1(38.86,82.97) v1(38.86,82.18) v1(39.49,12.58) v1(39.49,11.95) v1(39.49,11.31) v1(39.69,82.94) v1(39.69,82.18) v1(40.12,12.58) v1(40.12,11.95) v1(40.12,11.31) v1(40.58,82.94) v1(40.58,82.18) v1(40.95,18.78) v1(41.4,82.97) v1(41.4,82.18) v1(41.56,13.75) v1(41.91,76.34) v1(41.93,75.52) v1(41.89,54.94) v1(41.89,53.25) v1(41.89,51.56) v1(41.89,49.87) v1(41.89,48.18) v1(41.89,46.49) v1(41.89,44.8) v1(41.89,43.12) v1(41.89,41.43) v1(41.89,39.74) v1(42.23,82.94) v1(42.23,82.18) v1(42.23,81.3) v1(42.23,80.54) v1(42.19,14.41) v1(42.43,18.77) v1(42.69,76.34) v1(42.69,75.52) v1(42.66,12.58) v1(42.66,11.95) v1(42.66,11.31) v1(42.76,13.75) v1(43.12,82.94) v1(43.12,82.18) v1(43.12,81.3) v1(43.12,80.54) v1(43.29,12.58) v1(43.29,11.95) v1(43.29,11.31) v1(43.43,76.35) v1(43.45,75.53) v1(43.92,18.77) v1(44.01,82.95) v1(44.01,82.19) v1(44.01,81.31) v1(44.01,80.55) v1(44.21,76.35) v1(44.21,75.53) v1(44.9,82.95) v1(44.9,82.19) v1(44.9,81.31) v1(44.9,80.55) v1(44.95,76.35) v1(44.97,75.53) v1(45.25,29.75) v1(45.27,34.73) v1(45.27,33.17) v1(45.28,32.21) v1(45.35,18.75) v1(45.5,53.55) v1(45.61,58.62) v1(45.64,37.35) v1(45.64,36.71) v1(45.64,36.08) v1(45.73,83.02) v1(45.73,82.13) v1(45.71,81.3) v1(45.73,80.48) v1(45.73,77.94) v1(45.73,77.18) v1(45.71,76.35) v1(45.73,75.53) v1(45.74,50.31) v1(45.74,49.68) v1(45.74,49.04) v1(45.96,32.67) v1(46.07,52.89) v1(46.18,57.95) v1(46.28,37.35) v1(46.28,36.71) v1(46.28,36.08) v1(46.37,50.31) v1(46.37,49.68) v1(46.37,49.04) v1(46.49,83.02) v1(46.49,82.13) v1(46.49,81.3) v1(46.49,80.48) v1(46.49,77.94) v1(46.49,77.18) v1(46.49,76.35) v1(46.49,75.53) v1(46.69,53.55) v1(46.71,34.72) v1(46.68,32.22) v1(46.68,29.77) v1(46.81,58.62) v1(46.82,18.74) v1(46.86,26.54) v1(46.86,25.81) v1(46.86,25.08) v1(46.86,24.35) v1(46.86,23.62) v1(47.45,33.98) v1(48.25,33.16) v1(48.31,18.74) v1(50.2,2.97) v1(50.55,19.46) v1(50.81,60.12) v1(50.83,3.63) v1(51.08,24.96) v1(51.27,29.99) v1(51.4,2.97) v1(51.55,20.46) v1(51.55,19.45) v1(51.55,18.42) v1(52.11,41.51) v1(52.08,29.97) v1(52.16,10.44) v1(52.69,40.85) v1(52.73,9.78) v1(53.09,53.8) v1(53.28,51.71) v1(53.28,51.07) v1(53.28,50.44) v1(53.31,41.51) v1(53.41,22.21) v1(53.36,10.44) v1(53.62,52.93) v1(53.92,51.71) v1(53.92,51.07) v1(53.92,50.44) v1(54.08,53.8) v1(54.12,20.65) v1(54.12,20.01) v1(54.12,19.38) v1(54.22,22.72) v1(54.23,21.69) v1(54.76,20.65) v1(54.76,20.01) v1(54.76,19.38) v1(55.27,36.02) v1(55.31,4.92) v1(56.08,32.64) v1(56.21,5.78) v1(56.19,4.9) v1(56.34,36.85) v1(56.34,36.02) v1(56.4,46.46) v1(57.6,45.08) v1(57.61,13.93) v1(58.01,6.17) v1(58.88,37.27) v1(58.9,6.15) v1(58.97,20.14) v1(61.96,59.72) v1(62.53,59.06) v1(62.55,20.51) v1(62.65,51.23) v1(62.65,44.53) v1(62.57,19.69) v1(62.56,14.88) v1(62.6,12.51) v1(62.81,27.45) v1(63.16,59.72) v1(63.22,50.57) v1(63.22,43.87) v1(63.23,28.28) v1(63.31,21.24) v1(63.27,18.96) v1(63.33,15.6) v1(63.3,11.78) v1(63.72,27.44) v1(63.85,51.23) v1(63.85,44.53) v1(64.01,20.5) v1(64.03,19.69) v1(64.02,14.87) v1(64.06,12.51) v1(64.77,64.64) v1(65.4,65.02) v1(65.4,64.26) v1(65.92,16) v1(66.34,24.59) v1(66.36,19.8) v1(66.36,6.49) v1(66.61,12.45) v1(66.61,11.81) v1(66.61,11.18) v1(66.6,9.32) v1(66.6,8.68) v1(66.6,8.05) v1(66.64,4.1) v1(66.64,3.46) v1(66.64,2.83) v1(66.91,51.48) v1(66.91,50.29) v1(66.92,21.59) v1(66.92,20.57) v1(66.93,5.82) v1(66.99,23.81) v1(67.24,12.45) v1(67.24,11.81) v1(67.24,11.18) v1(67.24,9.32) v1(67.24,8.68) v1(67.24,8.05) v1(67.27,4.1) v1(67.27,3.46) v1(67.27,2.83) v1(67.55,6.49) v1(67.58,50.86) v1(68.06,18.02) v1(68.08,16.84) v1(68.07,15.67) v1(68.77,21.6) v1(68.98,83.02) v1(68.98,82.38) v1(68.96,81.75) v1(68.96,81.11) v1(69.65,83.02) v1(69.65,82.39) v1(69.63,81.75) v1(69.63,81.12) v1(69.7,55.29) v1(70.02,37.43) v1(70,36.46) v1(69.99,35.54) v1(70.25,40.26) v1(70.34,82.38) v1(70.33,81.75) v1(70.33,81.11) v1(70.27,54.63) v1(70.29,47.62) v1(70.29,46.13) v1(70.28,44.65) v1(70.26,43.23) v1(70.26,41.74) v1(70.85,15.36) v1(70.89,55.29) v1(70.91,12.71) v1(71.04,83.02) v1(71.04,82.39) v1(71.03,81.75) v1(71.03,81.12) v1(70.97,1.7) v1(70.97,1.06) v1(71.28,9.52) v1(71.28,8.88) v1(71.28,8.25) v1(71.28,7.47) v1(71.28,6.83) v1(71.28,6.2) v1(71.28,5.54) v1(71.28,4.9) v1(71.28,4.27) v1(71.28,3.61) v1(71.28,2.97) v1(71.28,2.34) v1(71.62,16.09) v1(71.6,11.98) v1(71.61,1.7) v1(71.61,1.06) v1(71.74,83.02) v1(71.74,82.38) v1(71.72,81.75) v1(71.72,81.11) v1(71.92,9.52) v1(71.92,8.88) v1(71.92,8.25) v1(71.92,7.47) v1(71.92,6.83) v1(71.92,6.2) v1(71.92,5.54) v1(71.92,4.9) v1(71.92,4.27) v1(71.92,3.61) v1(71.92,2.97) v1(71.92,2.34) v1(72.24,1.7) v1(72.24,1.06) v1(72.31,15.35) v1(72.37,12.71) v1(73.32,51.32) v1(73.75,40.34) v1(73.89,50.65) v1(73.86,43.64) v1(73.88,36.78) v1(74.32,39.67) v1(74.43,42.97) v1(74.45,36.12) v1(74.51,51.32) v1(74.94,40.34) v1(75.06,43.64) v1(75.08,36.78) v1(75.53,5.27) v1(75.76,8.37) v1(75.76,7.74) v1(75.76,7.1) v1(76.1,4.6) v1(76.4,8.37) v1(76.4,7.74) v1(76.4,7.1) v1(76.53,65.15) v1(76.47,63.97) v1(76.56,19.23) v1(76.72,5.27) v1(76.87,67.66) v1(76.95,23.38) v1(77.14,18.57) v1(77.41,65.74) v1(77.42,64.7) v1(77.47,68.6) v1(77.47,67.06) v1(77.51,49.71) v1(77.52,22.71) v1(77.76,19.23) v1(78.04,67.66) v1(78.04,66.27) v1(78.09,49.05) v1(78.15,23.38) v1(78.08,6.21) v1(78.08,5.57) v1(78.08,4.94) v1(78.71,49.71) v1(78.74,32.63) v1(78.71,6.21) v1(78.71,5.57) v1(78.71,4.94) v1(78.87,69.98) v1(78.87,69.21) v1(78.87,68.33) v1(78.87,67.03) v1(79.31,31.97) v1(79.63,68.83) v1(79.63,67.69) v1(79.62,3.54) v1(79.62,2.91) v1(79.62,2.27) v1(79.78,63.56) v1(79.78,62.92) v1(79.88,66.29) v1(79.93,32.63) v1(80.26,3.54) v1(80.26,2.91) v1(80.26,2.27) v1(80.39,67.05) v1(80.42,65.62) v1(80.42,63.56) v1(80.42,62.92) v1(80.74,29.36) v1(80.74,28.58) v1(80.77,72.67) v1(80.77,71.91) v1(80.77,71.14) v1(80.9,81.3) v1(80.9,80.54) v1(81.03,76.6) v1(81.05,66.28) v1(81.05,63.56) v1(81.05,62.92) v1(81.01,19.97) v1(81.01,19.34) v1(81.01,18.7) v1(81.54,72.67) v1(81.54,71.91) v1(81.54,71.14) v1(81.63,81.3) v1(81.63,80.53) v1(81.64,19.97) v1(81.64,19.34) v1(81.64,18.7) v1(81.79,60.07) v1(81.82,30.01) v1(82.3,72.67) v1(82.3,71.91) v1(82.3,71.14) v1(82.66,54.45) v1(82.66,53.82) v1(82.66,53.18) v1(82.66,49.55) v1(82.66,48.91) v1(82.66,48.28) v1(82.81,77.94) v1(83.1,41.53) v1(83.1,26.82) v1(83.09,10.38) v1(83.29,54.45) v1(83.29,53.82) v1(83.29,53.18) v1(83.29,49.55) v1(83.29,48.91) v1(83.29,48.28) v1(83.55,63.11) v1(83.67,40.86) v1(83.66,9.72) v1(83.77,22.71) v1(83.76,19.25) v1(84.2,77.94) v1(84.29,53.81) v1(84.34,50.38) v1(84.3,41.53) v1(84.34,22.04) v1(84.33,18.59) v1(84.29,10.38) v1(84.75,53.13) v1(84.79,49.7) v1(84.95,19.25) v1(85.03,63.1) v1(84.97,22.71) v1(85.18,53.81) v1(85.22,50.38) v1(85.2,32.6) v1(85.64,26.82) v1(85.66,78) v1(85.66,76.6) v1(85.77,31.93) v1(86.38,36.07) v1(86.4,32.6) v1(86.38,4.9) v1(86.52,63.1) v1(86.78,13.09) v1(86.81,12.3) v1(87.12,26.8) v1(87.45,45.75) v1(87.37,36.91) v1(87.38,36.08) v1(87.42,5.94) v1(87.41,4.92) v1(87.59,12.67) v1(87.88,26.8) v1(88.14,83.08) v1(88.14,82.32) v1(88.16,77.12) v1(88.16,76.36) v1(88.52,46.39) v1(88.65,26.8) v1(88.78,64.24) v1(88.78,63.6) v1(88.78,62.97) v1(88.9,83.08) v1(88.9,82.32) v1(88.9,81.56) v1(88.89,77.12) v1(88.89,76.35) v1(89.24,32.58) v1(89.41,64.24) v1(89.41,63.6) v1(89.41,62.97) v1(89.66,83.08) v1(89.66,82.32) v1(89.66,81.56) v1(89.68,77.12) v1(89.68,76.36) v1(89.82,31.92) v1(89.92,37.27) v1(89.9,6.17) v1(90.43,83.08) v1(90.43,82.32) v1(90.41,77.12) v1(90.41,76.35) v1(90.44,32.58) v1(90.55,79.14) v1(90.62,26.8) v1(91.38,26.8) v1(92.17,26.8) v1(92.83,73.43) v1(92.83,72.7) v1(92.83,71.91) v1(93.22,74.17) v1(93.22,71.12) v1(93.61,73.43) v1(93.6,72.7) v1(93.61,71.91) v1(93.65,56.04) v1(93.6,19.39) v1(93.68,50.34) v1(93.67,43.9) v1(93.65,32.58) v1(93.65,12.71) v1(94.22,55.37) v1(94.25,49.68) v1(94.24,43.24) v1(94.23,31.92) v1(94.2,28.28) v1(94.17,18.73) v1(94.23,12.05) v1(94.84,56.04) v1(94.85,32.58) v1(94.8,19.39) v1(94.85,12.71) v1(94.87,50.34) v1(94.86,43.9) v1(95.21,27.4) v1(95.38,64.79) v1(95.38,64.16) v1(96.01,80.92) v1(96.01,80.16) v1(96.01,64.79) v1(96.01,64.16) v1(97.57,25.15) v1(97.74,31.47) v1(98.22,68.19) v1(98.22,67.55) v1(98.22,66.92) v1(98.27,50.31) v1(98.27,49.68) v1(98.27,49.04) v1(98.27,47.91) v1(98.27,47.27) v1(98.27,46.64) v1(98.26,15.37) v1(98.35,2.44) v1(98.38,9.8) v1(98.38,8.31) v1(98.37,6.83) v1(98.35,5.4) v1(98.36,3.91) v1(98.51,40.71) v1(98.49,39.24) v1(98.48,37.76) v1(98.46,36.33) v1(98.53,34.82) v1(98.51,33.2) v1(98.51,31.47) v1(98.6,58.59) v1(98.6,57.96) v1(98.6,57.32) v1(98.63,22.61) v1(98.69,77.24) v1(98.69,76.61) v1(98.69,75.97) v1(98.86,68.19) v1(98.86,67.55) v1(98.86,66.92) v1(98.91,50.31) v1(98.91,49.68) v1(98.91,49.04) v1(98.91,47.91) v1(98.91,47.27) v1(98.91,46.64) v1(99.14,21.78) v1(99.23,58.59) v1(99.23,57.96) v1(99.23,57.32) v1(99.25,31.47) v1(99.32,77.24) v1(99.32,76.61) v1(99.32,75.97) v1(99.54,67.57) v1(99.54,66.94) v1(99.54,66.3) v1(99.69,22.6) v1(99.73,15.37) v1(100.09,83.09) v1(100.09,82.32) v1(100.09,81.56) v1(100.09,80.8) v1(100.17,67.57) v1(100.17,66.94) v1(100.17,66.3) v1(100.16,10.06) v1(100.16,9.43) v1(100.16,8.79) v1(100.16,6.86) v1(100.16,6.22) v1(100.16,5.59) v1(100.16,3.56) v1(100.16,2.93) v1(100.16,2.29) v1(100.82,83.09) v1(100.82,82.32) v1(100.82,81.56) v1(100.82,80.79) v1(100.79,10.06) v1(100.79,9.43) v1(100.79,8.79) v1(100.79,6.86) v1(100.79,6.22) v1(100.79,5.59) v1(100.79,3.56) v1(100.79,2.93) v1(100.79,2.29) v1(101.16,16.57) v1(101.62,83.09) v1(101.62,82.32) v1(101.62,81.56) v1(101.62,80.8) v1(102.15,17.57) v1(102.35,83.09) v1(102.35,82.32) v1(102.35,81.56) v1(102.35,80.79) v1(102.44,58.24) v1(102.44,57.61) v1(102.43,19.91) v1(103.14,83.09) v1(103.14,82.32) v1(103.14,81.56) v1(103.14,80.8) v1(103.07,58.24) v1(103.07,57.61) v1(103.41,22.06) v1(103.71,58.24) v1(103.71,57.61) v1(103.87,83.09) v1(103.87,82.32) v1(103.87,81.56) v1(103.87,80.79) v1(103.97,22.7) v1(104.25,41.58) v1(104.25,31.97) v1(104.16,31.09) v1(104.29,47.45) v1(104.28,45.98) v1(104.26,44.55) v1(104.26,43.06) v1(104.43,22.06) v1(104.41,19.92) v1(104.55,34.94) v1(104.55,34.31) v1(104.55,33.67) v1(104.67,83.09) v1(104.67,82.32) v1(104.67,81.56) v1(104.67,80.8) v1(104.88,31.47) v1(104.89,2.48) v1(105.03,66.95) v1(105,17.59) v1(105.21,58.69) v1(105.21,58.06) v1(105.21,57.42) v1(105.19,34.94) v1(105.19,34.31) v1(105.19,33.67) v1(105.4,83.09) v1(105.4,82.32) v1(105.4,81.56) v1(105.4,80.79) v1(105.41,22.05) v1(105.52,31.97) v1(105.52,31.09) v1(105.79,66.94) v1(105.79,66.21) v1(105.84,58.69) v1(105.84,58.06) v1(105.84,57.42) v1(106.42,77.35) v1(106.42,76.62) v1(106.42,75.83) v1(106.42,75.1) v1(106.36,2.47) v1(106.55,68.46) v1(106.55,67.73) v1(106.55,66.94) v1(106.55,66.21) v1(106.46,22.05) v1(106.47,19.9) v1(106.49,17.58) v1(106.94,31.1) v1(106.98,38.33) v1(107.19,77.35) v1(107.19,76.62) v1(107.19,75.83) v1(107.19,75.1) v1(107.32,68.46) v1(107.31,67.73) v1(107.32,66.94) v1(107.31,66.21) v1(107.55,37.67) v1(107.54,22.05) v1(107.82,17.57) v1(107.85,2.47) v1(107.95,77.35) v1(107.95,76.62) v1(107.95,75.83) v1(107.95,75.1) v1(108.08,68.46) v1(108.07,67.73) v1(108.08,66.94) v1(108.07,66.21) v1(108.18,38.33) v1(108.35,31.09) v1(108.46,81.81) v1(108.5,22.04) v1(108.71,76.62) v1(108.72,75.83) v1(108.71,75.1) v1(108.85,68.46) v1(108.85,67.73) v1(108.85,66.94) v1(109.24,17.57) v1(109.28,2.45) v1(109.86,59.66) v1(109.97,53.34) v1(110.33,57.39) v1(110.33,56.76) v1(110.33,56.12) v1(110.43,32.31) v1(110.64,19.91) v1(110.83,22.93) v1(110.76,2.44) v1(110.97,57.39) v1(110.97,56.76) v1(110.97,56.12) v1(111.7,31.1) v1(112.25,2.44) v1(112.28,17.86) v1(112.36,24) v1(112.36,22.73) v1(112.36,21.44) v1(112.52,28.7) v1(112.57,53.95) v1(112.57,53.32) v1(112.57,52.68) v1(112.57,51.14) v1(112.57,50.5) v1(112.57,49.87) v1(113.21,53.95) v1(113.21,53.32) v1(113.21,52.68) v1(113.21,51.14) v1(113.21,50.5) v1(113.21,49.87) v1(113.17,29.34) v1(113.98,77.88) v1(113.98,77.24) v1(113.98,76.6) v1(114.05,27.56) v1(114.05,21.44) v1(114.04,19.91) v1(114.08,41.54) v1(114.06,26.57) v1(114.1,10.32) v1(114.27,31.35) v1(114.27,29.46) v1(114.62,77.88) v1(114.62,77.24) v1(114.62,76.6) v1(114.65,40.88) v1(114.73,33.1) v1(114.67,9.65) v1(114.94,78.89) v1(115.11,20.66) v1(115.28,41.54) v1(115.29,19.62) v1(115.29,18.98) v1(115.29,18.35) v1(115.29,10.32) v1(115.57,54.23) v1(115.57,53.59) v1(115.57,51.82) v1(115.57,51.19) v1(115.57,50.55) v1(115.7,66.64) v1(115.7,66) v1(115.68,29.46) v1(115.92,19.62) v1(115.92,18.98) v1(115.92,18.35) v1(116.04,33.12) v1(116.07,20.66) v1(116.2,54.23) v1(116.2,53.59) v1(116.2,51.82) v1(116.2,51.19) v1(116.2,50.55) v1(116.27,12.87) v1(116.27,12.24) v1(116.27,11.6) v1(116.38,75.25) v1(116.9,12.87) v1(116.9,12.24) v1(116.9,11.6) v1(117.1,20.64) v1(117.15,28.28) v1(117.29,36.03) v1(117.26,4.92) v1(117.41,33.1) v1(117.86,66.19) v1(117.86,65.56) v1(118.31,37.31) v1(118.28,36.03) v1(118.38,6.17) v1(118.4,4.92) v1(118.49,66.83) v1(118.49,66.19) v1(118.49,65.56) v1(118.58,76.95) v1(118.58,46.46) v1(118.57,45.07) v1(118.69,31.4) v1(119.13,66.83) v1(119.13,66.19) v1(119.13,65.56) v1(119.19,33.12) v1(119.18,25.52) v1(119.51,68.22) v1(119.51,67.46) v1(119.6,13.93) v1(119.9,37.3) v1(120.11,76.74) v1(120.11,76.11) v1(120.11,75.47) v1(120.74,76.74) v1(120.74,76.11) v1(120.74,75.47) v1(120.91,37.29) v1(122.55,25.53) v1(122.87,80.03) v1(122.87,79.4) v1(122.87,78.76) v1(122.89,73.31) v1(122.89,72.67) v1(122.89,72.04) v1(122.89,67.94) v1(122.89,67.3) v1(122.89,66.67) v1(123.51,80.03) v1(123.51,79.4) v1(123.51,78.76) v1(123.52,73.31) v1(123.52,72.67) v1(123.52,72.04) v1(123.52,67.94) v1(123.52,67.3) v1(123.52,66.67) v1(124.67,51.24) v1(124.67,44.64) v1(124.68,20.08) v1(124.68,13.45) v1(124.93,56.47) v1(124.93,55.83) v1(124.93,55.2) v1(124.94,26.82) v1(124.97,29.72) v1(125.24,50.58) v1(125.24,43.98) v1(125.25,19.42) v1(125.25,12.78) v1(125.57,56.47) v1(125.57,55.83) v1(125.57,55.2) v1(125.6,27.39) v1(125.6,26.19) v1(125.74,28.98) v1(125.86,51.24) v1(125.86,44.64) v1(125.87,20.08) v1(125.88,13.45) v1(126.06,30.97) v1(126.9,30.16) v1(127.51,24.38) v1(127.48,20.48) v1(127.51,18.92) v1(127.51,17.14) v1(127.51,15.11) v2(39.38,25.51) v2(39.38,24.24) v2(40.02,24.87) v2(40.65,25.51) v2(40.65,24.24) v2(70.5,20.68) v2(70.5,18.9) v2(71.39,19.79) v2(72.15,20.68) v2(72.15,18.9) v2(91.63,76.48) v2(98.93,60.03) v2(100.2,56.41) v2(100.33,60.03) v2(101.15,25.98) v2(101.15,24.71) v2(101.76,60.02) v2(101.78,25.34) v2(102.06,56.42) v2(102.42,25.98) v2(102.42,24.71) v2(103.72,56.43) v2(104.52,60.03) v2(105.55,56.45) v2(106.17,60.03) v2(107.19,82.51) v2(109.6,82.51) v2(114.42,66.95) v2(114.37,65.56) v2(116.08,79.14) v2(120.4,70.96)
